# EasyEDA Pro project 四驱车.eprj

# Schematic 电机驱动板
Create Date: 2024-07-02; Page Name: P1; Project Name: 四驱车; Schematic Name: 电机驱动板; Update Date: 2024-08-28; Company: 嘉立创EDA; Page Size: A4; Version: V1.0
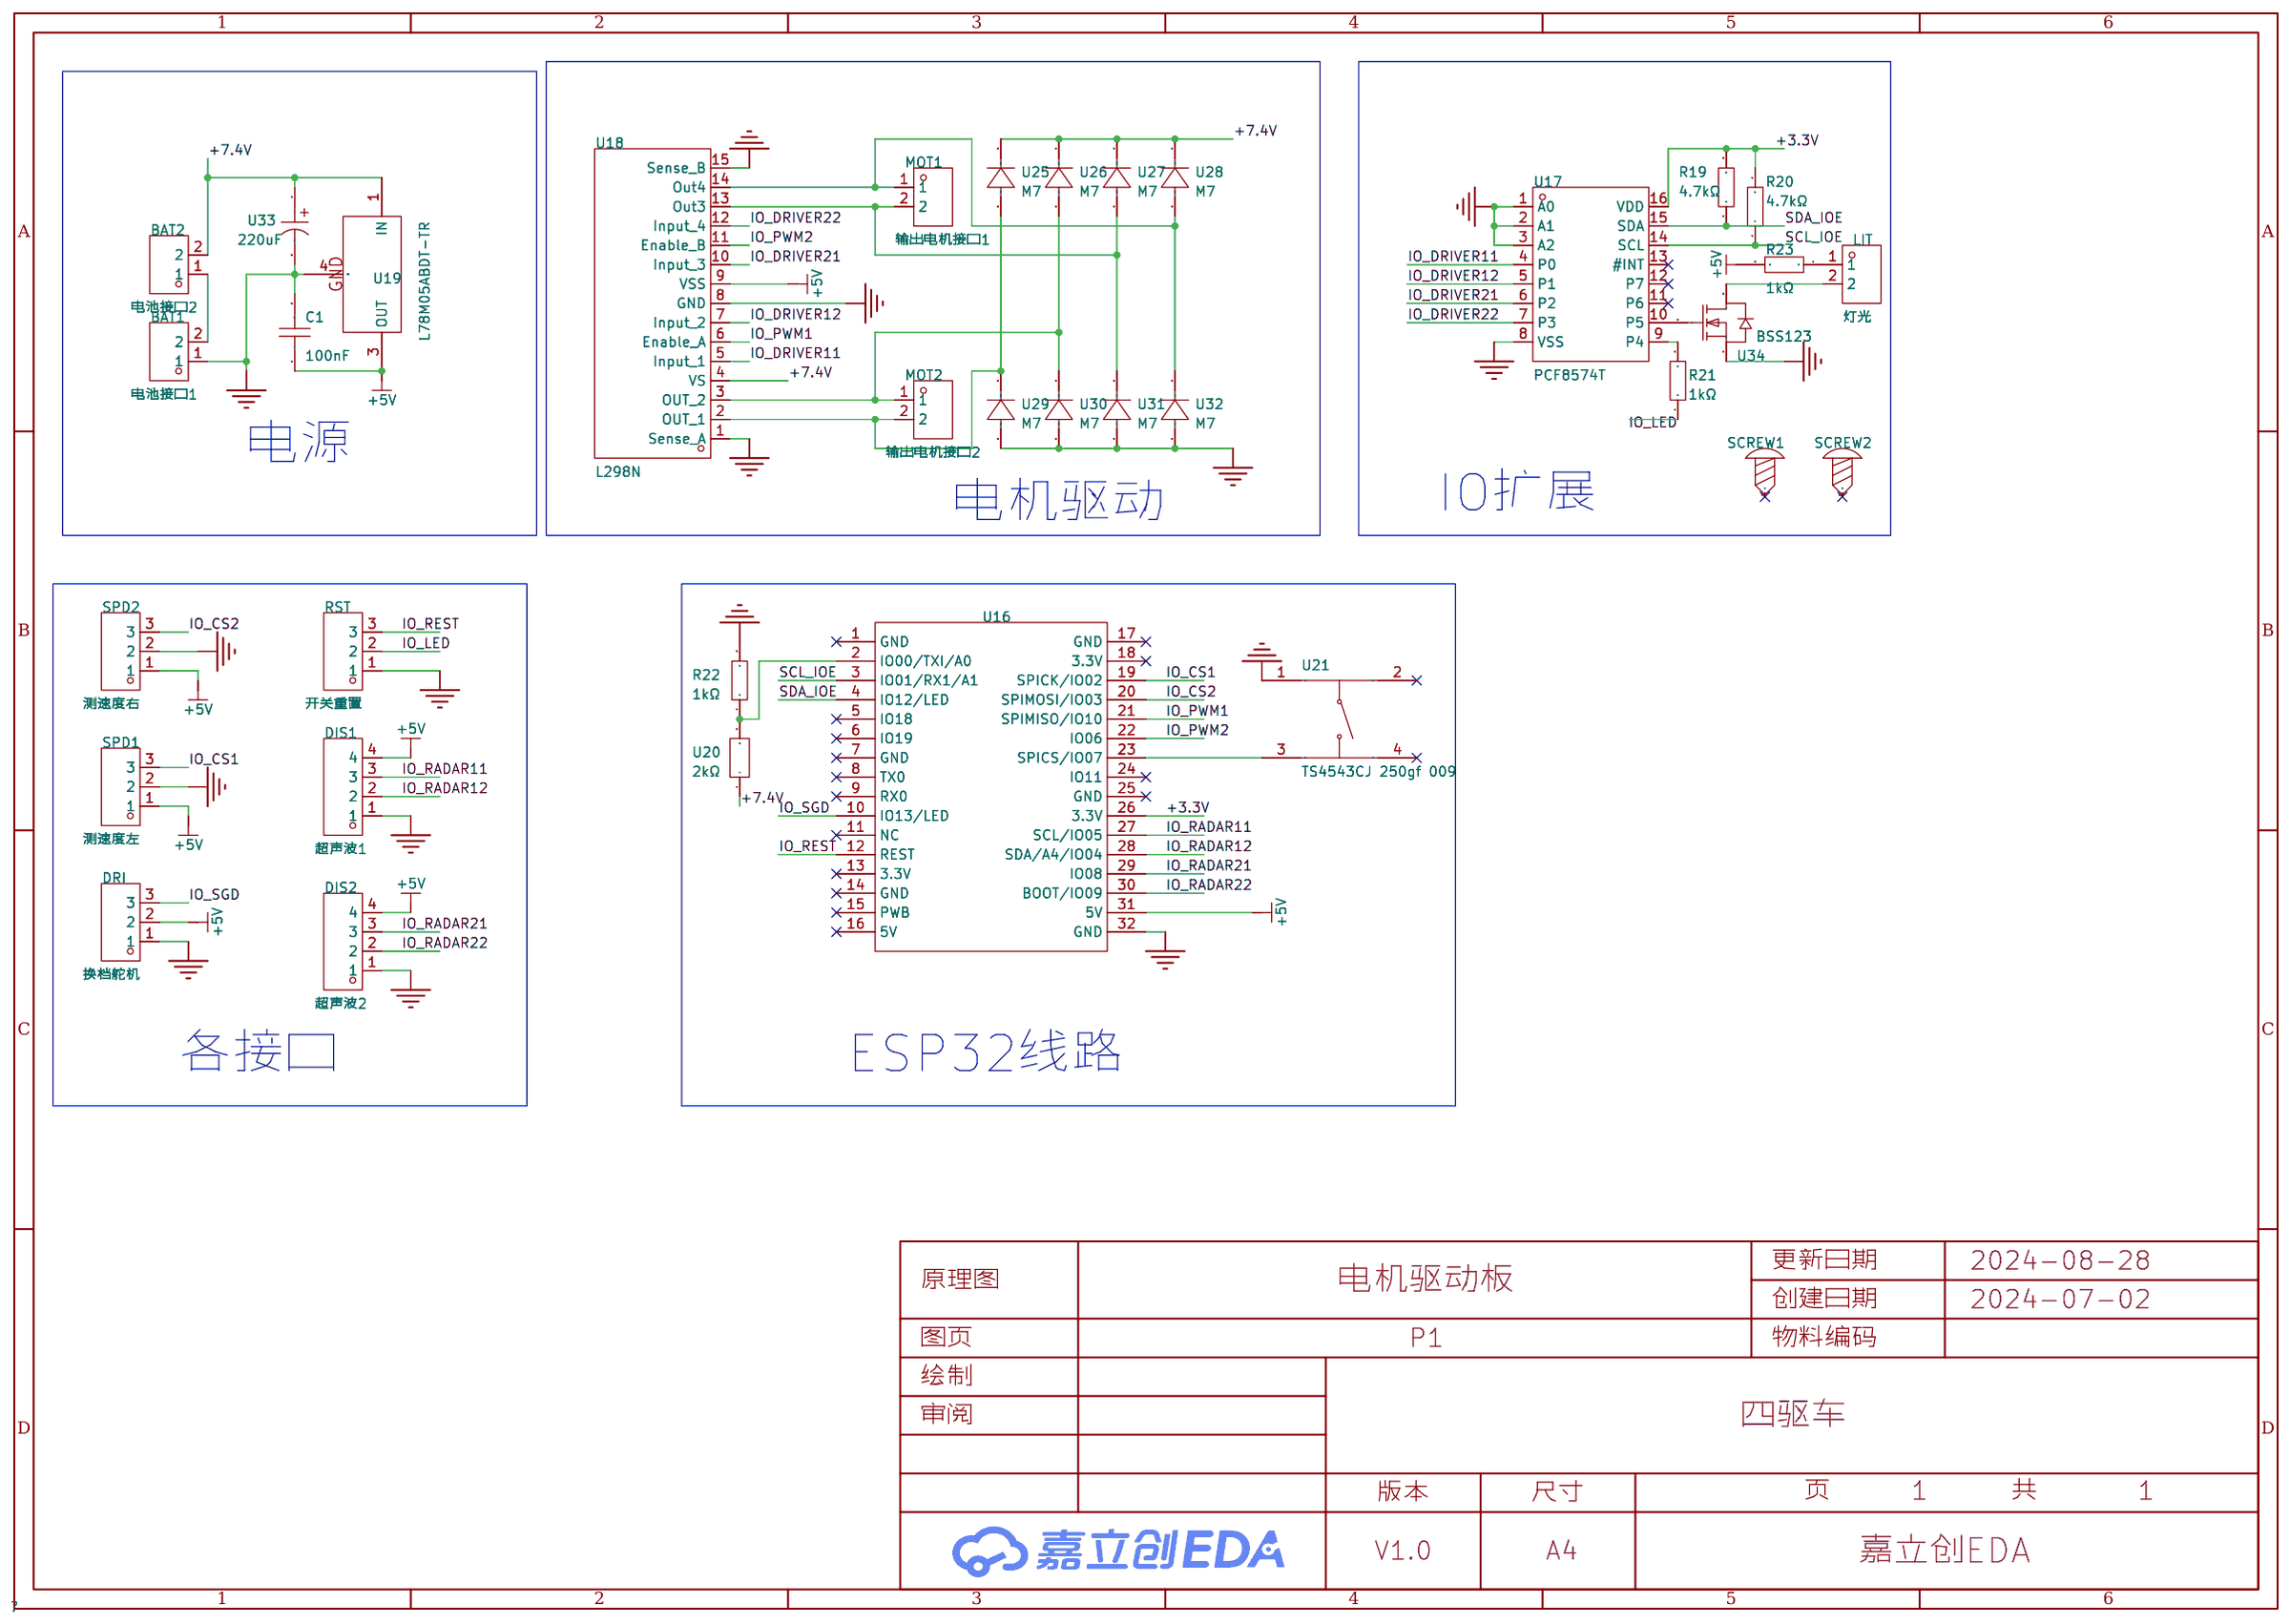
[diagram p0: schematic sheet]

## Parts
BAT1  电池接口1  [CONN-TH_2P-P2.50_HX25003-2A]
BAT2  电池接口2  [CONN-TH_2P-P2.50_HX25003-2A]
C1  100nF  [C0805]
DIS1  超声波1  [CONN-TH_4P-P2.50_4PIN]
DIS2  超声波2  [CONN-TH_4P-P2.50_4PIN]
DRI  换档舵机  [CONN-TH_3P-P2.54_2501S-3P]
LIT  灯光  [CONN-TH_2P-P2.50_HX25003-2A]
MOT1  输出电机接口1  [CONN-TH_2P-P2.50_HX25003-2A]
MOT2  输出电机接口2  [CONN-TH_2P-P2.50_HX25003-2A]
R19  4.7kΩ  [R0805]
R20  4.7kΩ  [R0805]
R21  1kΩ  [R0805]
R22  1kΩ  [R0805]
R23  1kΩ  [R0805]
RST  开关重置  [CONN-TH_3P-P2.54_2501S-3P]
SCREW1  -  [M2螺丝]
SCREW2  -  [M2螺丝]
SPD1  测速度左  [CONN-TH_3P-P2.54_2501S-3P]
SPD2  测速度右  [CONN-TH_3P-P2.54_2501S-3P]
U16  ESP32C3-合宙  [esp32c3-合宙]
U17  PCF8574T  [SOP-16_L10.3-W7.5-P1.27-LS10.4-BL]
U18  L298N  [MULTIWATT-15_L19.6-W5.0-P1.27-L]
U19  L78M05ABDT-TR  [TO-252-2_L6.5-W6.1-P4.58-LS10.0-TL]
U20  2kΩ  [R0603]
U21  TS4543CJ 250gf 009  [SW-TH_4P-L4.5-W4.5-P3.00-LS5.0]
U25  M7  [SMA_L4.5-W2.7-LS5.1-RD]
U26  M7  [SMA_L4.5-W2.7-LS5.1-RD]
U27  M7  [SMA_L4.5-W2.7-LS5.1-RD]
U28  M7  [SMA_L4.5-W2.7-LS5.1-RD]
U29  M7  [SMA_L4.5-W2.7-LS5.1-RD]
U30  M7  [SMA_L4.5-W2.7-LS5.1-RD]
U31  M7  [SMA_L4.5-W2.7-LS5.1-RD]
U32  M7  [SMA_L4.5-W2.7-LS5.1-RD]
U33  220uF  [CAP-SMD_BD8.0-L8.3-W8.3-LS9.1-FD]
U34  BSS123  [SOT-23-3_L2.9-W1.3-P1.90-LS2.4-BR]

## Library data of the parts
BAT1 BAT2 LIT MOT1 MOT2 = ZX-XH2.54-2PZZ: 插针结构:1x2P;间距:2.54mm;安装方式:直插;参考系列:XH;总PIN数:2P;排数:1;每排PIN数:2;行距:-;额定电流:3A;触头材质:黄铜;触头镀层:锡;工作温度范围:-25℃~+85℃;; Supplier Part: C7429632; Manufacturer: Megastar(兆星); Supplier Footprint: 插件,P=2.54mm; JLCPCB Part Class: Extended Part; Datasheet: https://atta.szlcsc.com/upload/public/pdf/source/20230619/19BA6947230AA44A04D3EDD65E618FD0.pdf; Supplier: LCSC; Pins Structure: 1x2P; Pitch: 2.54mm; Mounting Style: 直插; Reference Series: XH; Number of Pins: 2P; Number of Rows: 1; Number of PINs Per Row: 2; Current Rating (Max): 3A; Contact Material: 黄铜; Contact Plating: 锡; Operating Temperature Range: -25℃~+85℃
C1 = C0805B104K500NT: 容值:100nF;精度:±10%;额定电压:50V;材质(温度系数):X7R;; LCSC Part Name: 100nF ±10% 50V; Supplier Part: C476766; Manufacturer: TORCH(火炬); Supplier Footprint: 0805; JLCPCB Part Class: 扩展库; Datasheet: https://atta.szlcsc.com/upload/public/pdf/source/20191230/C476766_171E30D5B7F7164A8210B8E948DFBAE0.pdf; Supplier: LCSC; Tolerance: ±10%; Voltage Rated: 50V; Temperature Coefficient: X7R
DIS1 DIS2 = ZX-XH2.54-4PZZ: 插针结构:1x4P;间距:2.54mm;安装方式:直插;参考系列:XH;总PIN数:4P;排数:1;每排PIN数:4;行距:-;额定电流:3A;触头材质:黄铜;触头镀层:锡;工作温度范围:-25℃~+85℃;; Supplier Part: C7429634; Manufacturer: Megastar(兆星); Supplier Footprint: 插件,P=2.54mm; JLCPCB Part Class: 扩展库; Datasheet: https://atta.szlcsc.com/upload/public/pdf/source/20230619/B529A2163E0159A644AB3383D208FB03.pdf; Supplier: LCSC; Pins Structure: 1x4P; Pitch: 2.54mm; Mounting Style: 直插; Reference Series: XH; Number of Pins: 4P; Number of Rows: 1; Number of PINs Per Row: 4; Current Rating (Max): 3A; Contact Material: 黄铜; Contact Plating: 锡; Operating Temperature Range: -25℃~+85℃
DRI RST SPD1 SPD2 = ZX-XH2.54-3PZZ: 插针结构:1x3P;间距:2.54mm;安装方式:直插;参考系列:XH;总PIN数:3P;排数:1;每排PIN数:3;行距:-;额定电流:3A;触头材质:黄铜;触头镀层:锡;工作温度范围:-25℃~+85℃;; Supplier Part: C7429633; Manufacturer: Megastar(兆星); Supplier Footprint: 插件,P=2.54mm; JLCPCB Part Class: 扩展库; Datasheet: https://atta.szlcsc.com/upload/public/pdf/source/20230619/AE17037A2CFDBE8D9CBA775D61AD0A84.pdf; Supplier: LCSC; Pins Structure: 1x3P; Pitch: 2.54mm; Mounting Style: 直插; Reference Series: XH; Number of Pins: 3P; Number of Rows: 1; Number of PINs Per Row: 3; Current Rating (Max): 3A; Contact Material: 黄铜; Contact Plating: 锡; Operating Temperature Range: -25℃~+85℃
R19 R20 = 0805W8F4701T5E: 电阻类型:厚膜电阻;阻值:4.7kΩ;精度:±1%;功率:125mW;最大工作电压:150V;温度系数:±100ppm/℃;; LCSC Part Name: 4.7kΩ ±1% 125mW 厚膜电阻; Supplier Part: C17673; Manufacturer: UNI-ROYAL(厚声); Supplier Footprint: 0805; JLCPCB Part Class: 基础库; Datasheet: https://atta.szlcsc.com/upload/public/pdf/source/20200306/C422600_1E6D84923E4A46A82E41ADD87F860B5C.pdf; Supplier: LCSC; Type: 厚膜电阻; Tolerance: ±1%; Power(Watts): 125mW; Overload Voltage (Max): 150V; Temperature Coefficient: ±100ppm/℃; Operating Temperature Range: -55℃~+155℃
R21-R23 = RC0805FR-071KL: 电阻类型:厚膜电阻;阻值:1kΩ;精度:±1%;功率:125mW;最大工作电压:150V;温度系数:±100ppm/℃;; LCSC Part Name: 厚膜电阻 1kΩ ±1% 125mW; Supplier Part: C95781; Manufacturer: YAGEO(国巨); Supplier Footprint: 0805; JLCPCB Part Class: 扩展库; Datasheet: https://atta.szlcsc.com/upload/public/pdf/source/20170708/1499509500945.pdf; Supplier: LCSC; Type: 厚膜电阻; Tolerance: ±1%; Power(Watts): 125mW; Overload Voltage (Max): 150V; Temperature Coefficient: ±100ppm/℃; Operating Temperature Range: -55℃~+155℃
SCREW1 SCREW2 = M2螺丝: Supplier Footprint: 插件
U16 = ESP32C3-合宙: ESP32C3-核心板-经典
U17 = PCF8574T: 接口:I2C;I/O数量:8;时钟频率:100kHz;; LCSC Part Name: 端口扩展芯片; Supplier Part: C398075; Manufacturer: HGSEMI(华冠); Supplier Footprint: SOP-16-300mil; JLCPCB Part Class: Extended Part; Datasheet: https://atta.szlcsc.com/upload/public/pdf/source/20190611/C398075_1925312D8618E19C6137781D5B71A3CA.pdf; Supplier: LCSC; Interface: I2C; Number of I/O: 8; Interrupt Output: 有中断输出; Output Type: 推挽式; Supply Voltage: 2.5V~6V; Output Source current: 300uA; Output Sink Current: 25mA; Clock Frequency: 100kHz; Operating Temperature: -40℃~+85℃
U18 = L298N_C19922: 驱动配置:半桥;电源电压:4.5V~7V;; Supplier Part: C19922; Manufacturer: ST(意法半导体); Supplier Footprint: MultiwAtt-15; JLCPCB Part Class: 扩展库; Datasheet: https://atta.szlcsc.com/upload/public/pdf/source/20131014/1457706655076.pdf; Supplier: LCSC; Driven Configuration: 半桥; Supply Voltage: 4.5V~7V; Feature: 过流保护(OCP)；过热保护(OPT); Operating Temperature: -40℃~+150℃@(Tj)
U19 = L78M05ABDT-TR: 输出类型:固定;最大输入电压:35V;输出电压:5V;最大输出电流:500mA;电源纹波抑制比(PSRR):62dB@(120Hz);输出极性:正极;; LCSC Part Name: 输入35V 输出5V 500mA; Supplier Part: C58069; Manufacturer: ST(意法半导体); Supplier Footprint: TO-252-2(DPAK); JLCPCB Part Class: 基础库; Datasheet: https://atta.szlcsc.com/upload/public/pdf/source/20230728/311D30A65517FCBD6FE5D1CCA2CA8430.pdf; Supplier: LCSC; Output Type: 固定; Maximum Input Voltage: 35V; Output Voltage: 5V; MAX Output Current: 500mA; Power Supply Rejection Ratio (PSRR): 62dB@(120Hz); standby current: 6mA; Operating Temperature: -40℃~+125℃; Output Polarity: 正极; Number of Outputs: 1
U20 = RCA032KFLF: 阻值:2kΩ;精度:±1%;功率:100mW;; LCSC Part Name: 2kΩ ±1% 100mW; Supplier Part: C22369799; Manufacturer: HKR(香港电阻); Supplier Footprint: 0603; JLCPCB Part Class: 扩展库; Datasheet: https://atta.szlcsc.com/upload/public/pdf/source/20240327/626E23E3B2A799D2C85303DE2C37BB2A.pdf; Supplier: LCSC; Tolerance: ±1%; Power(Watts): 100mW
U21 = TS4543CJ 250gf 009: 电路结构:单刀单掷;按钮形状:圆形按钮;作用力:250gf;安装方式:直插;开关长度:4.5mm;开关宽度:4.5mm;开关高度:4.3mm;带支架:不带;触点电流:50mA;额定电压(AC):-;额定电压(DC):12V;额定功率:-;绝缘电阻:100MΩ;带灯:无;机械寿命:10万次;; LCSC Part Name: 4.5*4.5*4.3mm 立插 轻触开关; Supplier Part: C5359331; Manufacturer: SHOU HAN(首韩); Supplier Footprint: 插件; JLCPCB Part Class: 扩展库; Datasheet: https://atta.szlcsc.com/upload/public/pdf/source/20230213/DC0D7DCCF73BB7038FD4B4E5EA59A8FD.pdf; Supplier: LCSC; Circuit: 单刀单掷; Actuator Style: 圆形按钮; Operating Force: 250gf; Mounting Style: 直插; Switch Length: 4.5mm; Switch Width: 4.5mm; Switch Height: 4.3mm; Strike Gundam: 不带; Contact Current: 50mA; Voltage Rating (DC): 12V; Insulation Resistance: 100MΩ; Actuator/Cap Color: 黑色; With Lamp: 无; Mechanical Life: 10万次; Operating Temperature: -25℃~+70℃
U25-U32 = M7_C2902910: 二极管配置:-;正向压降(Vf):1.1V@1A;直流反向耐压(Vr):1kV;整流电流:1A;; LCSC Part Name: 电压:1kV 电流:1A; Supplier Part: C2902910; Manufacturer: MSKSEMI(美森科); Supplier Footprint: DO-214AC; JLCPCB Part Class: 扩展库; Datasheet: https://atta.szlcsc.com/upload/public/pdf/source/20230818/6D837163743024F173AA17A66C45A9BC.pdf; Supplier: LCSC; Forward Voltage (Vf@If): 1.1V@1A; Reverse Voltage (Vr): 1kV; Rectified Current: 1A; Reverse Leakage Current: 5uA@1kV
U33 = RVT1V221M0810 220UF 35V: 容值:220uF;精度:±20%;额定电压:35V;纹波电流:195mA@120Hz;等效串联电阻:-;; LCSC Part Name: 220uF ±20% 35V; Supplier Part: C970697; Manufacturer: DMBJ(振宝佳); Supplier Footprint: SMD,D8xL10.2mm; JLCPCB Part Class: 扩展库; Datasheet: https://atta.szlcsc.com/upload/public/pdf/source/20201217/C970594_282EC4D70669AEE33806F6C24A5FAA0B.pdf; Supplier: LCSC; Tolerance: ±20%; Rated Voltage: 35V; Ripple Current: 195mA@120Hz; φD: 8mm; L: 10.2mm; Lifetime @ Temp: 2800hrs@105℃; Operating Temperature: -55℃~+105℃
U34 = BSS123_C7420338: 类型:N沟道;漏源电压(Vdss):100V;连续漏极电流(Id):200mA;功率(Pd):350mW;导通电阻(RDS(on)@Vgs,Id):5Ω@10V,0.2A;阈值电压(Vgs(th)@Id):2.5V@250uA;; LCSC Part Name: N沟道 耐压:100V 电流:200mA; Supplier Part: C7420338; Manufacturer: 宏迦橙; Supplier Footprint: SOT-23; JLCPCB Part Class: 扩展库; Datasheet: https://atta.szlcsc.com/upload/public/pdf/source/20230828/221D2EA3EA52D2251D08D49BEAAE0395.pdf; Supplier: LCSC; Type: N沟道; Drain Source Voltage (Vdss): 100V; Continuous Drain Current (Id): 200mA; Power Dissipation (Pd): 350mW; Drain Source On Resistance (RDS(on)@Vgs,Id): 5Ω@10V,0.2A; Gate Threshold Voltage (Vgs(th)@Id): 2.5V@250uA; Total Gate Charge (Qg@Vgs): 1.4nC@10V; Input Capacitance (Ciss@Vds): 32pF@50V; Reverse Transfer Capacitance (Crss@Vds): 7pF@50V; Operating Temperature: -55℃~+150℃

## Nets
+3.3V: R19.2 R20.2 U16.26(3.3V) U17.16(VDD)
+5V: C1.1 DIS1.4 DIS2.4 DRI.2 R23.2 SPD1.1 SPD2.1 U16.31(5V) U18.9(VSS) U19.3(OUT)
+7.4V: BAT2.2 U18.4(VS) U19.1(IN) U20.1 U25.1(Cathode) U26.1(Cathode) U27.1(Cathode) U28.1(Cathode) U33.1
GND: BAT1.1 C1.2 DIS1.1 DIS2.1 DRI.1 R22.2 RST.1 SPD1.2 SPD2.2 U16.32(GND) U17.1(A0) U17.2(A1) U17.3(A2) U17.8(VSS) U18.1(Sense A) U18.8(GND) U18.15(Sense B) U19.4(GND) U21.1 U29.2(Anode) U30.2(Anode) U31.2(Anode) U32.2(Anode) U33.2 U34.2(S)
IO_CS1: SPD1.3 U16.19(SPICK/IO02)
IO_CS2: SPD2.3 U16.20(SPIMOSI/IO03)
IO_DRIVER11: U17.4(P0) U18.5(Input 1)
IO_DRIVER12: U17.5(P1) U18.7(Input 2)
IO_DRIVER21: U17.6(P2) U18.10(Input 3)
IO_DRIVER22: U17.7(P3) U18.12(Input 4)
IO_LED: R21.1 RST.2
IO_PWM1: U16.21(SPIMISO/IO10) U18.6(Enable A)
IO_PWM2: U16.22(IO06) U18.11(Enable B)
IO_RADAR11: DIS1.3 U16.27(SCL/IO05)
IO_RADAR12: DIS1.2 U16.28(SDA/A4/IO04)
IO_RADAR21: DIS2.3 U16.29(IO08)
IO_RADAR22: DIS2.2 U16.30(BOOT/IO09)
IO_REST: RST.3 U16.12(REST)
IO_SGD: DRI.3 U16.10(IO13/LED)
SCL_IOE: R20.1 U16.3(IO01/RX1/A1) U17.14(SCL)
SDA_IOE: R19.1 U16.4(IO12/LED) U17.15(SDA)
$1N15876: BAT1.2 BAT2.1
$1N17735: R22.1 U16.2(IO00/TXI/A0) U20.2
$1N18534: U16.23(SPICS/IO07) U21.3
$1N19447: MOT2.1 U18.3(OUT 2) U26.2(Anode) U30.1(Cathode)
$1N19452: MOT2.2 U18.2(OUT 1) U25.2(Anode) U29.1(Cathode)
$1N19565: MOT1.1 U18.14(Out4) U28.2(Anode) U32.1(Cathode)
$1N19566: MOT1.2 U18.13(Out3) U27.2(Anode) U31.1(Cathode)
$1N24130: R21.2 U17.9(P4)
$1N26486: U17.10(P5) U34.1(G)
$1N26625: LIT.2 U34.3(D)
$1N26643: LIT.1 R23.1

Not connected (* = marked no-connect by the designer): SCREW1 1*; SCREW2 1*; U16 1(GND)* 5(IO18)* 6(IO19)* 7(GND)* 8(TX0)* 9(RX0)* 11(NC)* 13(3.3V)* 14(GND)* 15(PWB)* 16(5V)* 17(GND)* 18(3.3V)* 24(IO11)* 25(GND)*; U17 11(P6)* 12(P7)* 13(#INT)*; U21 2* 4*

## Notes on the sheet
- 电源
- 电机驱动
- IO扩展
- 各接口
- ESP32线路

# Schematic TP2326充电
Create Date: 2024-08-18; Page Name: P1; Project Name: 四驱车; Schematic Name: Schematic2; Update Date: 2024-08-18; Company: 嘉立创EDA; Page Size: A4; Version: V1.0
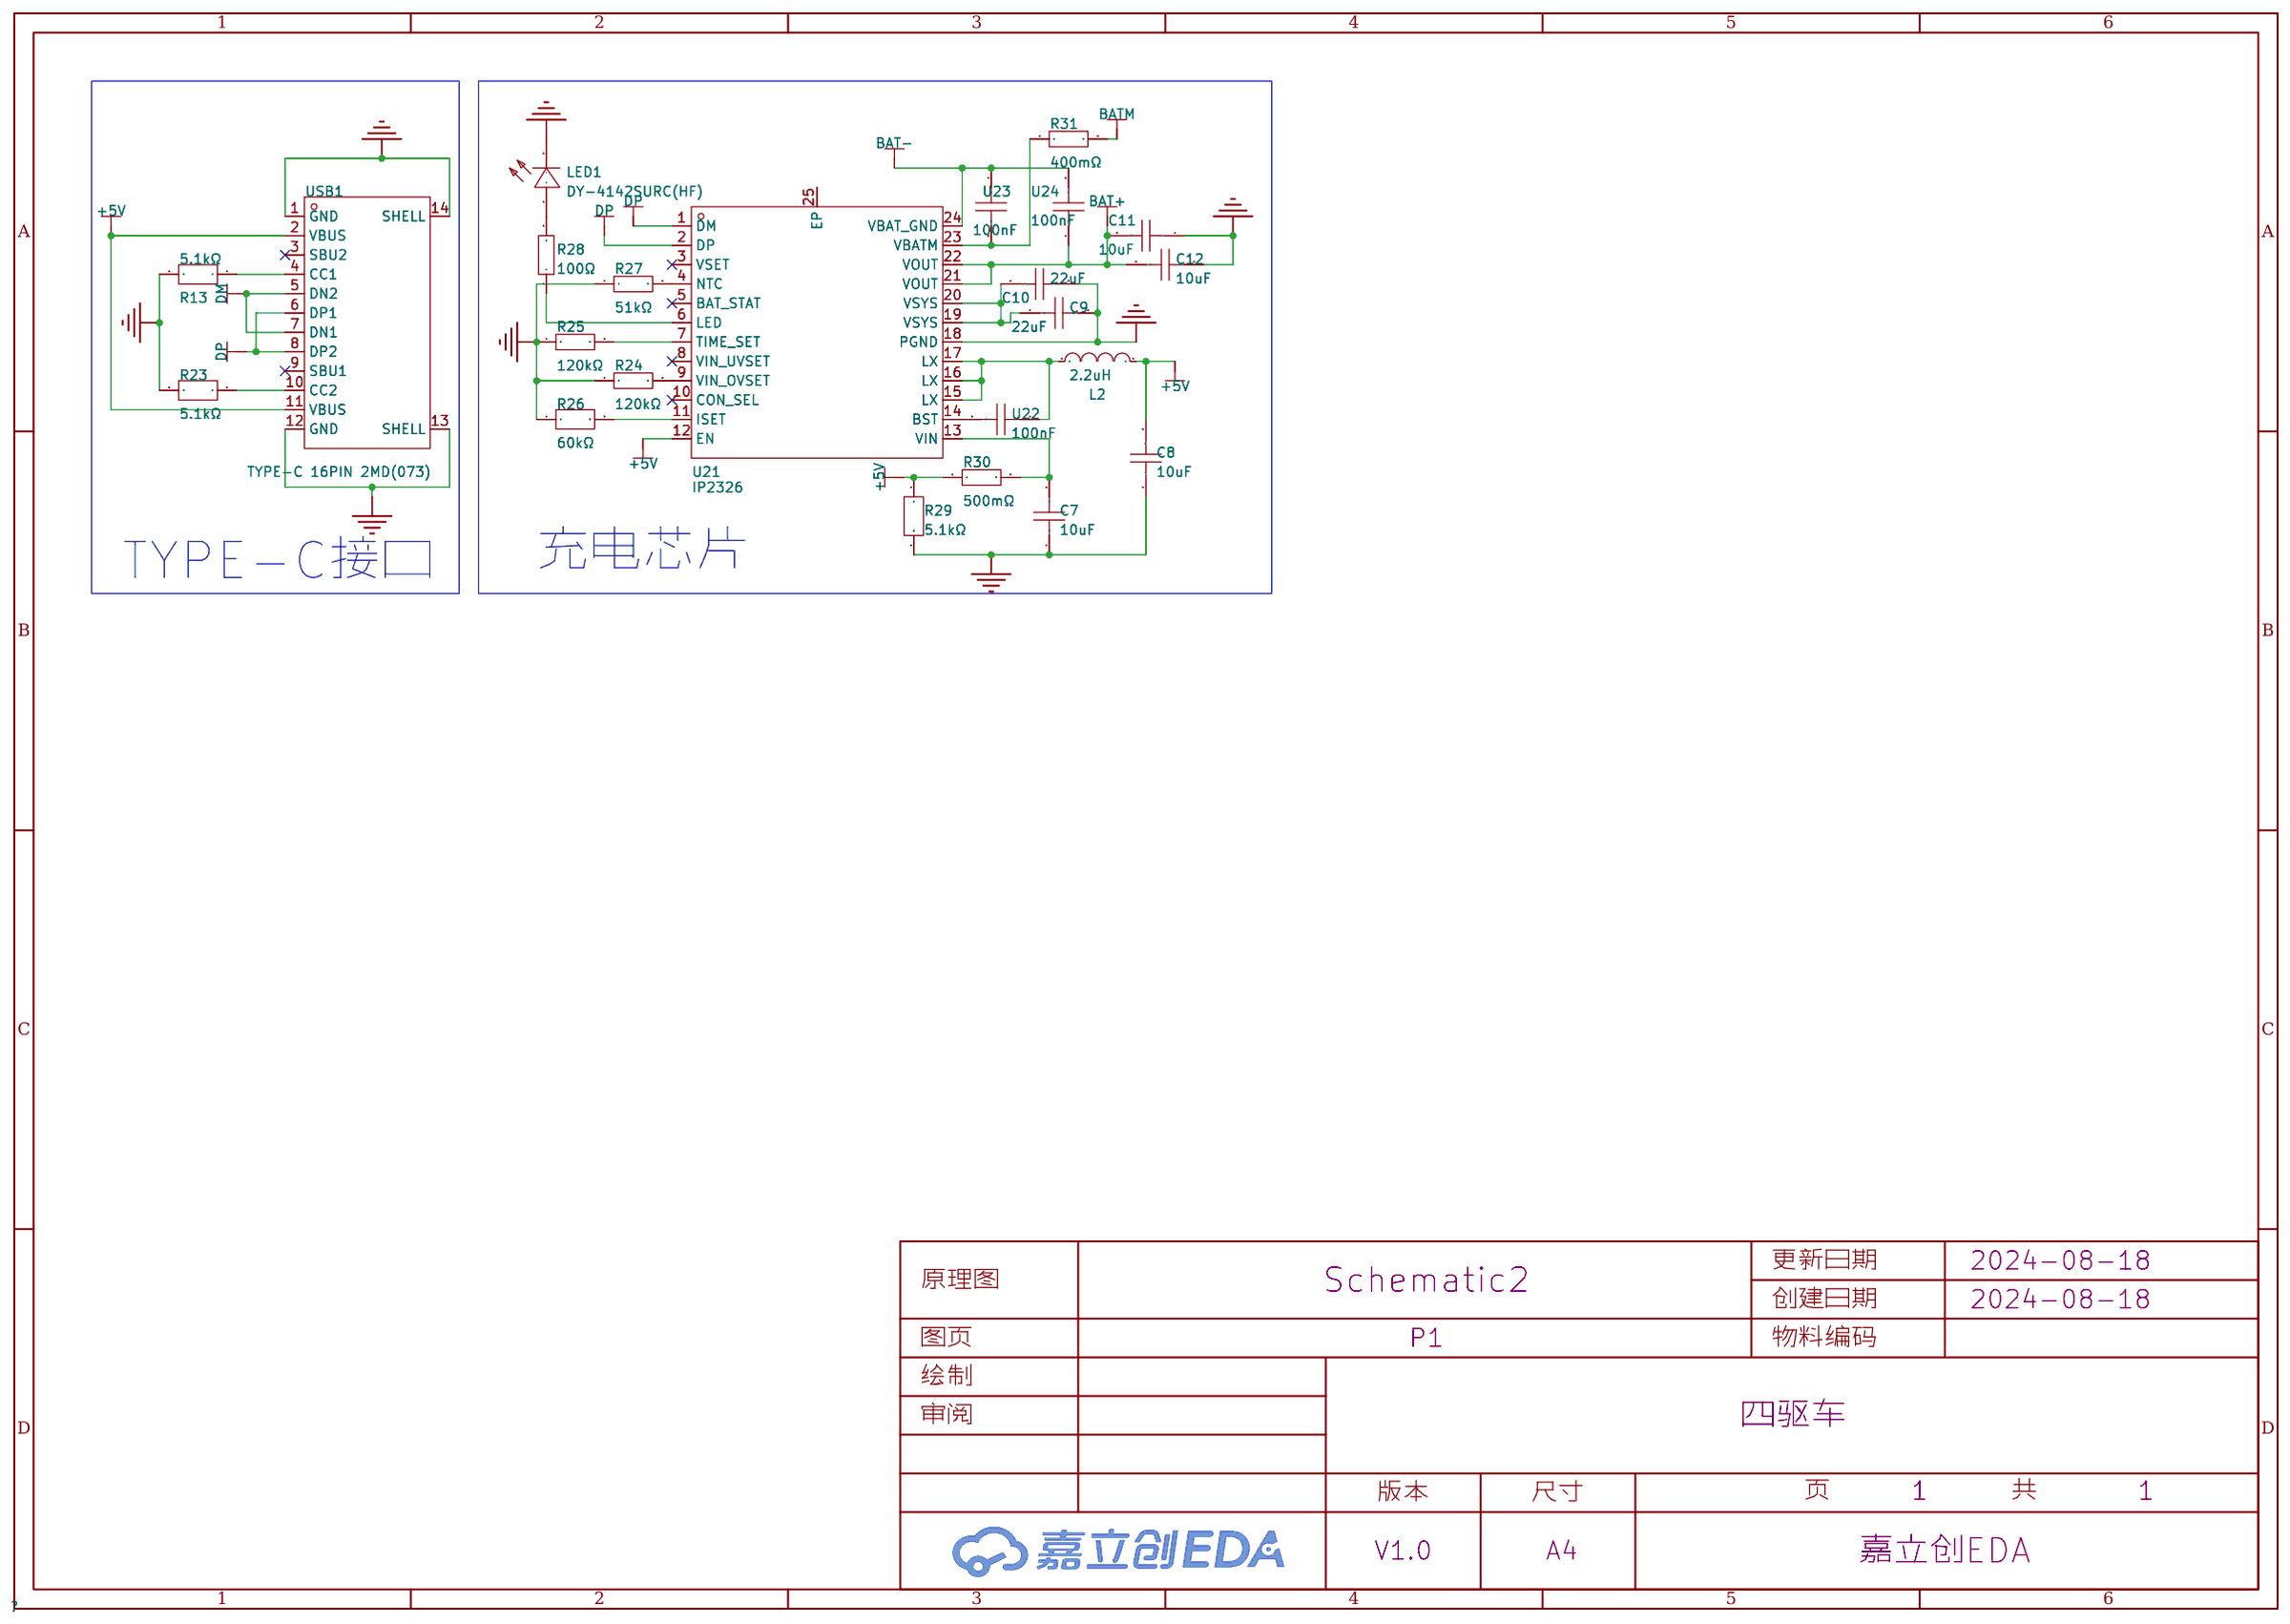
[diagram p1: schematic sheet]

## Parts
C7  10uF  [C0603]
C8  10uF  [C0603]
C9  22uF  [C0603]
C10  22uF  [C0603]
C11  10uF  [C0603]
C12  10uF  [C0603]
L2  2.2uH  [IND-SMD_L7.8-W7.0_SCD0705N]
LED1  DY-4142SURC(HF)  [LED-TH_BD5.0-P2.54-FD]
R13  5.1kΩ  [R0603]
R23  5.1kΩ  [R0603]
R24  120kΩ  [R0603]
R25  120kΩ  [R0603]
R26  60kΩ  [R0603]
R27  51kΩ  [R0603]
R28  100Ω  [R0603]
R29  5.1kΩ  [R0603]
R30  500mΩ  [R0603]
R31  400mΩ  [R0603]
U21  IP2326  [VQFN-24_L4.0-W4.0-P0.50-BL-EP2.5]
U22  100nF  [C0603]
U23  100nF  [C0603]
U24  100nF  [C0603]
USB1  TYPE-C 16PIN 2MD(073)  [USB-C-SMD_TYPE-C-6PIN-2MD-073]

## Library data of the parts
C7 C8 C11 C12 = CL10A106MQ8NNNC: 容值:10uF;精度:±20%;额定电压:6.3V;材质(温度系数):X5R;; LCSC Part Name: 10uF ±20% 6.3V; Supplier Part: C1691; Manufacturer: SAMSUNG(三星); Supplier Footprint: 0603; JLCPCB Part Class: 扩展库; Datasheet: https://atta.szlcsc.com/upload/public/pdf/source/20160218/1457707763339.pdf; Supplier: LCSC; Tolerance: ±20%; Voltage Rated: 6.3V; Temperature Coefficient: X5R
C9 C10 = CL10A226MQ8NRNC: 容值:22uF;精度:±20%;额定电压:6.3V;材质(温度系数):X5R;; LCSC Part Name: 22uF ±20% 6.3V; Supplier Part: C59461; Manufacturer: SAMSUNG(三星); Supplier Footprint: 0603; JLCPCB Part Class: 基础库; Datasheet: https://atta.szlcsc.com/upload/public/pdf/source/20160218/1457707763339.pdf; Supplier: LCSC; Tolerance: ±20%; Voltage Rated: 6.3V; Temperature Coefficient: X5R
L2 = SM7850-2R2MT: 电感值:2.2uH;精度:±20%;额定电流:-;饱和电流(Isat):6A;; LCSC Part Name: 2.2uH ±20% 6A; Supplier Part: C9908; Manufacturer: SXN(顺翔诺); Supplier Footprint: SMD; JLCPCB Part Class: 扩展库; Datasheet: https://atta.szlcsc.com/upload/public/pdf/source/20210810/DE909F839CF261ABDAA312DFDF4FA1A6.pdf; Supplier: LCSC; Tolerance: ±20%; Saturation Current (Isat): 6A; DC Resistance (DCR): 15mΩ
LED1 = DY-4142SURC(HF): 灯头类型:5.1mm圆柱形灯头;发光颜色:红色;正向电压(VF):1.8V~2.4V;功率:60mW;正向电流:20mA;主波长:620nm~630nm;二极管配置:-;透镜颜色:无色透明透镜;色温:-;发光强度:63mcd~200mcd;发光角度:85°;载带方式:-;工作温度:-25℃~+80℃;; Supplier Part: C459127; Manufacturer: TONYU(东裕); Supplier Footprint: 插件,D=5.1mm; JLCPCB Part Class: 扩展库; Datasheet: https://atta.szlcsc.com/upload/public/pdf/source/20191121/C459127_C28EC13B80F89695C0023DDCA5A32C9E.pdf; Supplier: LCSC; Lamp Holder Type: 5.1mm圆柱形灯头; Emitted Color: 红色; Forward Voltage (VF): 1.8V~2.4V; Power Dissipation: 60mW; Forward Current: 20mA; Dominant Wavelength: 620nm~630nm; Peak Wavelength: 633nm; Lens Color: 无色透明透镜; Luminous Intensity: 63mcd~200mcd; Viewing Angle: 85°; Operating Temperature: -25℃~+80℃
R13 R23 R29 = SCR0603J5K1: 电阻类型:厚膜电阻;阻值:5.1kΩ;精度:±5%;功率:100mW;最大工作电压:75V;; LCSC Part Name: 厚膜电阻 5.1kΩ ±5% 100mW; Supplier Part: C3017721; Manufacturer: VO(翔胜); Supplier Footprint: 0603; JLCPCB Part Class: 扩展库; Datasheet: https://atta.szlcsc.com/upload/public/pdf/source/20220513/247AF9639BA21CF93567DC289CCC6A22.pdf; Supplier: LCSC; Type: 厚膜电阻; Tolerance: ±5%; Power(Watts): 100mW; Overload Voltage (Max): 75V; Operating Temperature Range: -55℃~+155℃
R24 R25 = 0603WAF1203T5E: 电阻类型:厚膜电阻;阻值:120kΩ;精度:±1%;功率:100mW;最大工作电压:75V;温度系数:±100ppm/℃;; LCSC Part Name: 120kΩ ±1% 100mW 厚膜电阻; Supplier Part: C25808; Manufacturer: UNI-ROYAL(厚声); Supplier Footprint: 0603; JLCPCB Part Class: 基础库; Datasheet: https://atta.szlcsc.com/upload/public/pdf/source/20200306/C422600_1E6D84923E4A46A82E41ADD87F860B5C.pdf; Supplier: LCSC; Type: 厚膜电阻; Tolerance: ±1%; Power(Watts): 100mW; Overload Voltage (Max): 75V; Temperature Coefficient: ±100ppm/℃; Operating Temperature Range: -55℃~+155℃
R26 = 0603WAF6002T5E: 电阻类型:厚膜电阻;阻值:60kΩ;精度:±1%;功率:100mW;最大工作电压:75V;温度系数:±100ppm/℃;; LCSC Part Name: 60kΩ ±1% 100mW 厚膜电阻; Supplier Part: C2767205; Manufacturer: UNI-ROYAL(厚声); Supplier Footprint: 0603; JLCPCB Part Class: 扩展库; Datasheet: https://atta.szlcsc.com/upload/public/pdf/source/20200306/C422600_1E6D84923E4A46A82E41ADD87F860B5C.pdf; Supplier: LCSC; Type: 厚膜电阻; Tolerance: ±1%; Power(Watts): 100mW; Overload Voltage (Max): 75V; Temperature Coefficient: ±100ppm/℃; Operating Temperature Range: -55℃~+155℃
R27 = 0603WAF5102T5E: 电阻类型:厚膜电阻;阻值:51kΩ;精度:±1%;功率:100mW;最大工作电压:75V;温度系数:±100ppm/℃;; LCSC Part Name: 51kΩ ±1% 100mW 厚膜电阻; Supplier Part: C23196; Manufacturer: UNI-ROYAL(厚声); Supplier Footprint: 0603; JLCPCB Part Class: 基础库; Datasheet: https://atta.szlcsc.com/upload/public/pdf/source/20200306/C422600_1E6D84923E4A46A82E41ADD87F860B5C.pdf; Supplier: LCSC; Type: 厚膜电阻; Tolerance: ±1%; Power(Watts): 100mW; Overload Voltage (Max): 75V; Temperature Coefficient: ±100ppm/℃; Operating Temperature Range: -55℃~+155℃
R28 = RC0603FR-07100RL: 电阻类型:厚膜电阻;阻值:100Ω;精度:±1%;功率:100mW;最大工作电压:75V;温度系数:±100ppm/℃;; LCSC Part Name: 厚膜电阻 100Ω ±1% 100mW; Supplier Part: C105588; Manufacturer: YAGEO(国巨); Supplier Footprint: 0603; JLCPCB Part Class: 扩展库; Datasheet: https://atta.szlcsc.com/upload/public/pdf/source/20180316/70C0E2BDAE7FCC62C531A5A58D202EE1.pdf; Supplier: LCSC; Type: 厚膜电阻; Tolerance: ±1%; Power(Watts): 100mW; Overload Voltage (Max): 75V; Temperature Coefficient: ±100ppm/℃; Operating Temperature Range: -55℃~+155℃
R30 = 0603WAF500LT5E: 电阻类型:厚膜电阻;阻值:500mΩ;精度:±1%;功率:100mW;最大工作电压:75V;温度系数:±800ppm/℃;; LCSC Part Name: 500mΩ ±1% 100mW 厚膜电阻; Supplier Part: C45312; Manufacturer: UNI-ROYAL(厚声); Supplier Footprint: 0603; JLCPCB Part Class: 扩展库; Datasheet: https://atta.szlcsc.com/upload/public/pdf/source/20200306/C422600_1E6D84923E4A46A82E41ADD87F860B5C.pdf; Supplier: LCSC; Type: 厚膜电阻; Tolerance: ±1%; Power(Watts): 100mW; Overload Voltage (Max): 75V; Temperature Coefficient: ±800ppm/℃; Operating Temperature Range: -55℃~+155℃
R31 = 0603WAJ040KT5E: 电阻类型:厚膜电阻;阻值:400mΩ;精度:±5%;功率:100mW;最大工作电压:75V;; LCSC Part Name: 400mΩ ±5% 100mW 厚膜电阻; Supplier Part: C2907422; Manufacturer: UNI-ROYAL(厚声); Supplier Footprint: 0603; JLCPCB Part Class: 扩展库; Supplier: LCSC; Type: 厚膜电阻; Tolerance: ±5%; Power(Watts): 100mW; Overload Voltage (Max): 75V; Operating Temperature Range: -55℃~+155℃
U21 = IP2326: Supplier Part: C2832094; Manufacturer: INJOINIC(英集芯); Supplier Footprint: VQFN-24-EP(4x4); JLCPCB Part Class: 扩展库; Datasheet: https://atta.szlcsc.com/upload/public/pdf/source/20210701/C2832094_E17C44C11E64EBC07E8B83E7E48DDEF6.pdf; Supplier: LCSC
U22-U24 = CGA0603X7R104K500JT: 容值:100nF;精度:±10%;额定电压:50V;材质(温度系数):X7R;; LCSC Part Name: 100nF ±10% 50V; Supplier Part: C6119867; Manufacturer: HRE(芯声); Supplier Footprint: 0603; JLCPCB Part Class: 扩展库; Supplier: LCSC; Tolerance: ±10%; Voltage Rated: 50V; Temperature Coefficient: X7R
USB1 = TYPE-C 16PIN 2MD(073): 连接器类型:Type-C;标准:-;公母:母;端口数量:1;触点数量:16P;安装方式:卧贴;额定电流 - 电源:5A;工作温度范围:-25℃~+85℃;; LCSC Part Name: Type-C 母 卧贴; Supplier Part: C2765186; Manufacturer: SHOU HAN(首韩); Supplier Footprint: SMD; JLCPCB Part Class: 扩展库; Datasheet: https://atta.szlcsc.com/upload/public/pdf/source/20211123/39B17C16241EAC15C5E277BDA434118E.pdf; Supplier: LCSC; Connector Type: Type-C; Gender: 母; Number of Ports: 1; Number of Contacts: 16P; Mounting Style: 卧贴; Current Rating - Power (Max): 5A; Operating Temperature Range: -25℃~+85℃

## Nets
+5V: C8.2 L2.2 R29.1 R30.1 U21.12(EN) USB1.2(VBUS) USB1.11(VBUS)
GND: C7.1 C8.1 C9.2 C10.2 C11.1 C12.1 LED1.2(-) R13.2 R23.2 R24.1 R25.1 R26.1 R27.1 R29.2 U21.18(PGND) USB1.1(GND) USB1.12(GND) USB1.13(SHELL) USB1.14(SHELL)
BAT+: C11.2 C12.2 U21.21(VOUT) U21.22(VOUT) U24.1
BAT-: U21.24(VBAT_GND) U23.1 U24.2
BATM: R31.2
DM: USB1.5(DN2) USB1.7(DN1)
DP: U21.1(DM) U21.2(DP) USB1.6(DP1) USB1.8(DP2)
Net-(C7-2): C7.2 R30.2 U21.13(VIN)
Net-(C9-1): C9.1 C10.1 U21.19(VSYS) U21.20(VSYS)
Net-(L2-1): L2.1 U21.15(LX) U21.16(LX) U21.17(LX) U22.1
Net-(LED1-1): LED1.1(+) R28.2
Net-(R13-1): R13.1 USB1.4(CC1)
Net-(R23-1): R23.1 USB1.10(CC2)
Net-(R24-2): R24.2 U21.9(VIN_OVSET)
Net-(R25-2): R25.2 U21.7(TIME_SET)
Net-(R26-2): R26.2 U21.11(ISET)
Net-(R27-2): R27.2 U21.4(NTC)
Net-(R28-1): R28.1 U21.6(LED)
Net-(R31-1): R31.1 U21.23(VBATM) U23.2
Net-(U21-14): U21.14(BST) U22.2

Not connected (* = marked no-connect by the designer): U21 3(VSET)* 5(BAT_STAT)* 8(VIN_UVSET)* 10(CON_SEL)* 25(EP); USB1 3(SBU2)* 9(SBU1)*

## Notes on the sheet
- TYPE-C接口
- 充电芯片

# Schematic 状态及开关
Create Date: 2024-08-26; Page Name: P1; Project Name: 四驱车; Schematic Name: Schematic1; Update Date: 2024-08-26; Company: 嘉立创EDA; Page Size: A4; Version: V1.0
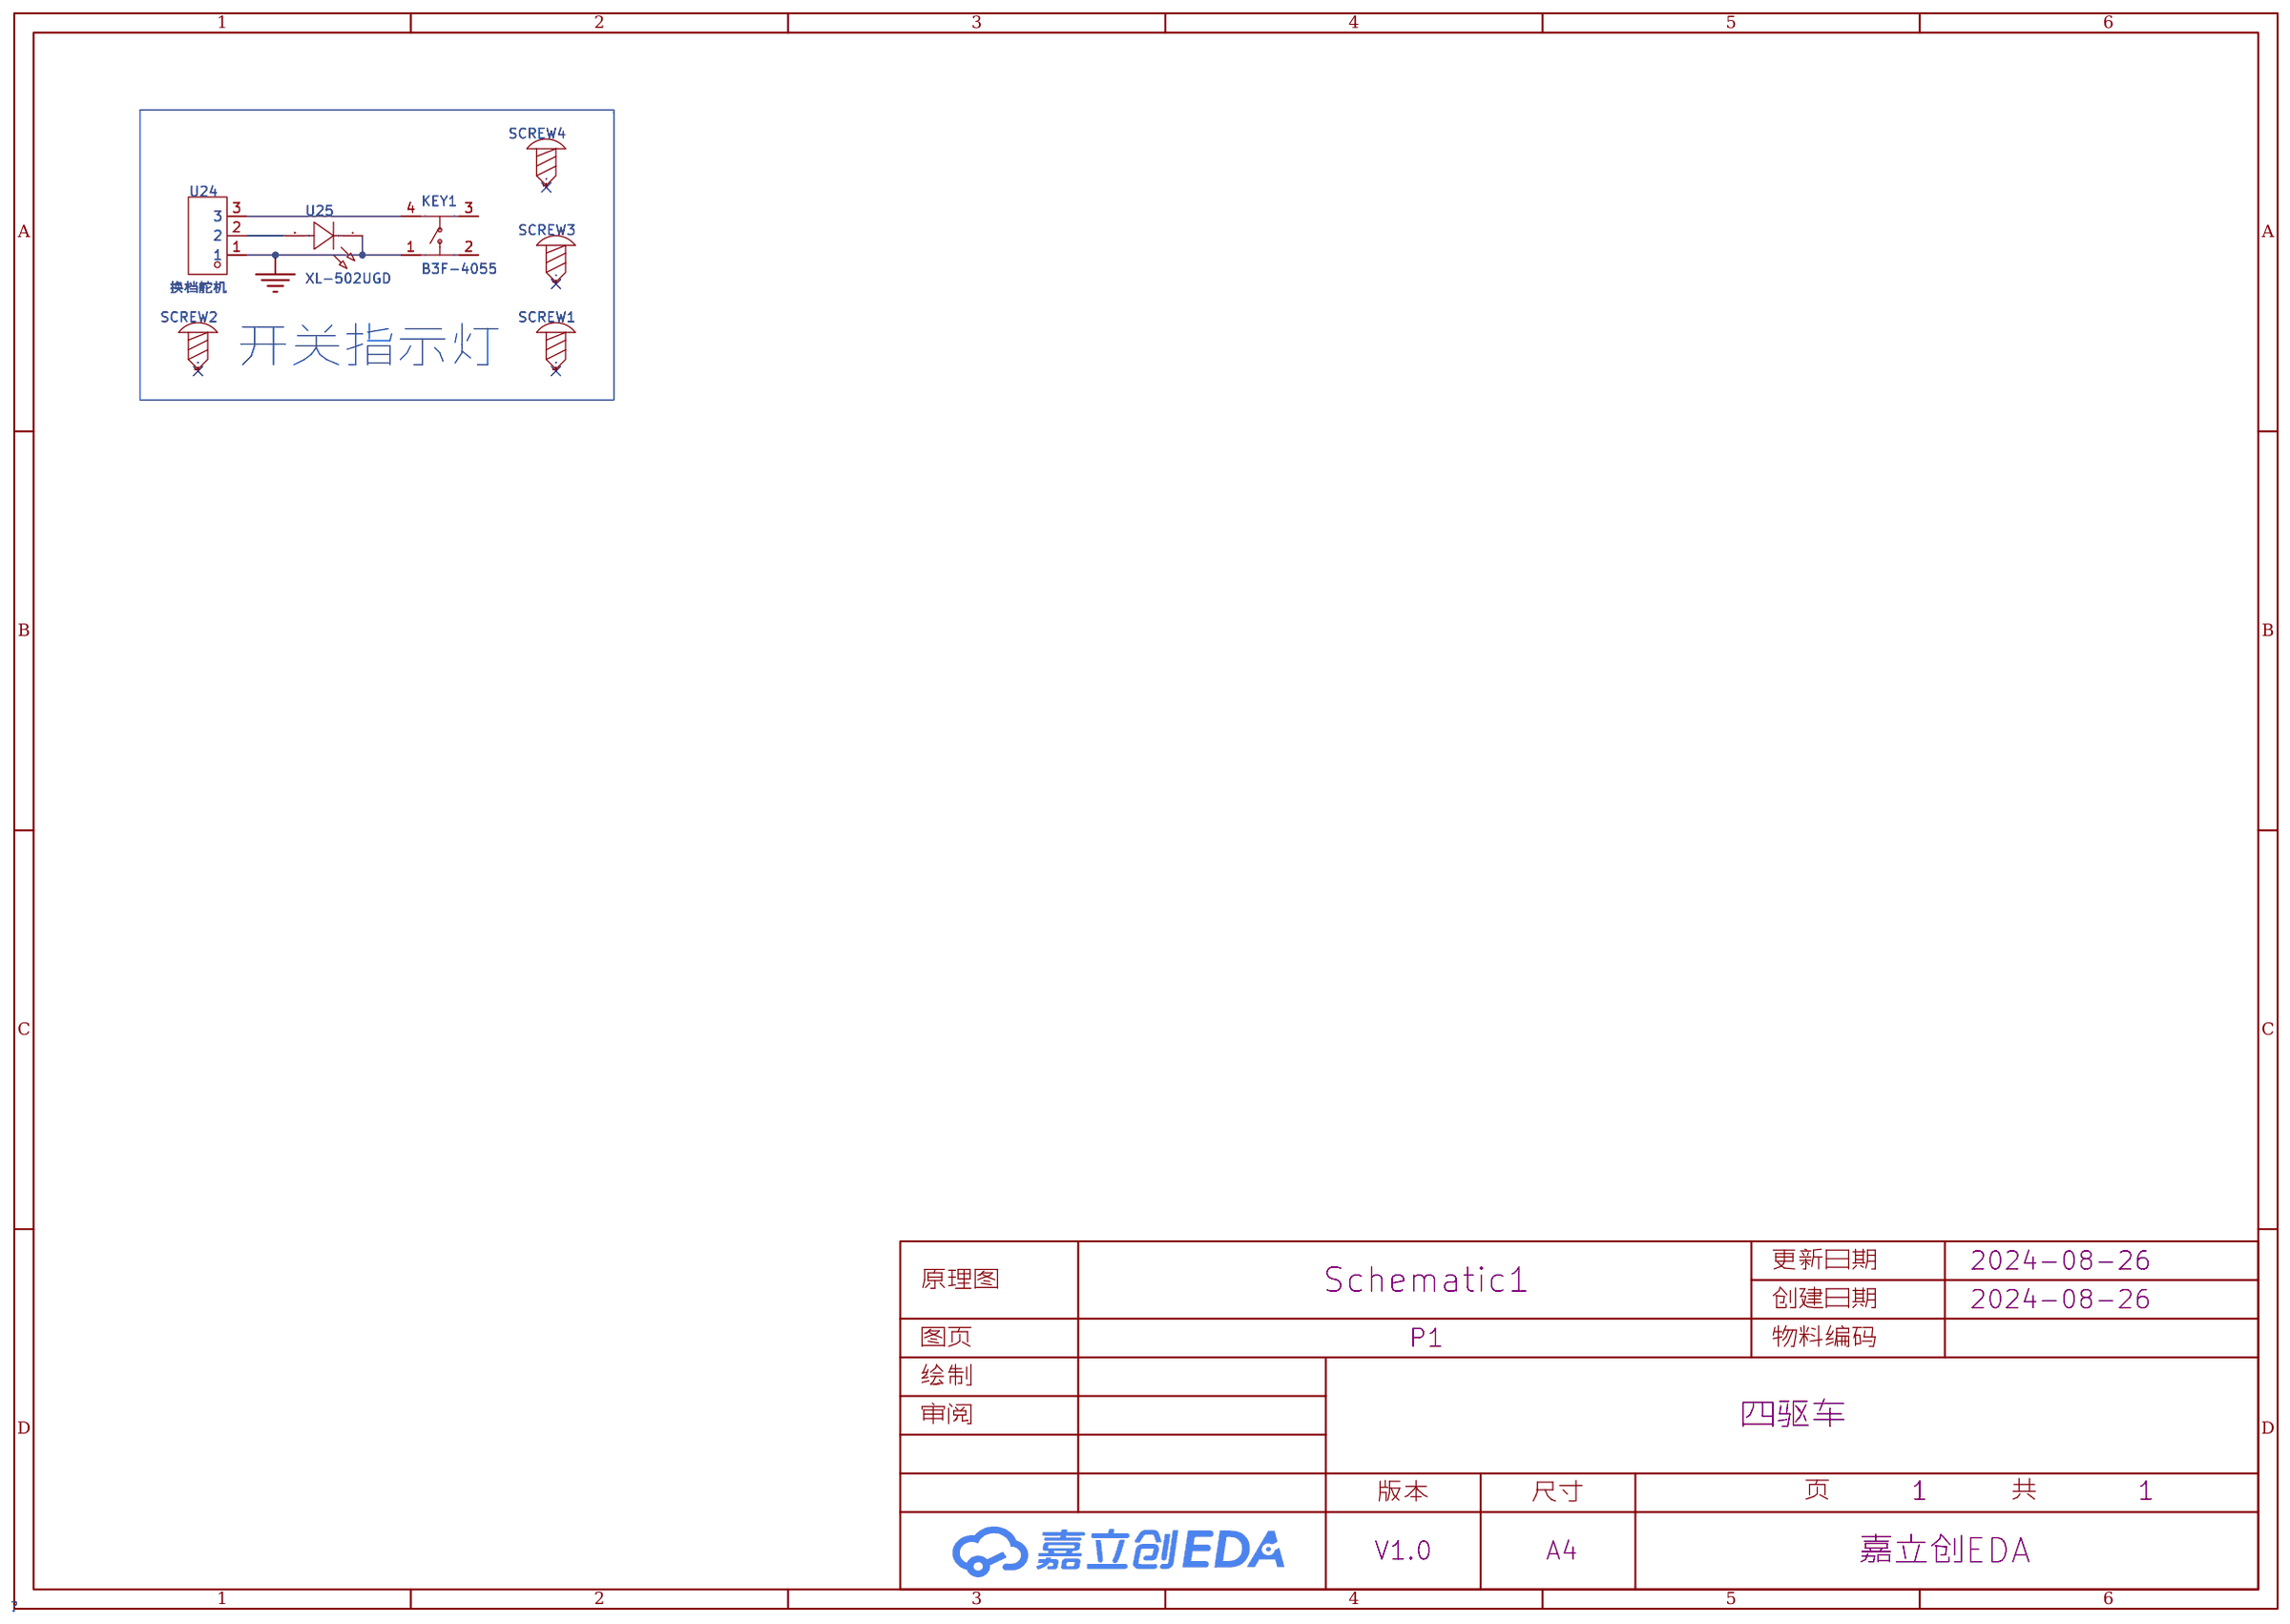
[diagram p2: schematic sheet]

## Parts
KEY1  B3F-4055  [KEY-TH_4P-L12.0-W12.0-P5.00-LS13.4-EH]
SCREW1  -  [M2螺丝]
SCREW2  -  [M2螺丝]
SCREW3  -  [M2螺丝]
SCREW4  -  [M2螺丝]
U24  换档舵机  [CONN-TH_3P-P2.54_2501S-3P]
U25  XL-502UGD  [LED-TH_BD5.9-P2.54-RD_GREEN]

## Library data of the parts
KEY1 = B3F-4055_C84931: 电路结构:单刀单掷;按钮形状:矩形按钮;安装方式:直插;开关长度:12mm;开关宽度:12mm;开关高度:7.3mm;触点电流:50mA;额定电压(DC):24V;带灯:-;机械寿命:-;; LCSC Part Name: 12*12*7.3mm 直插 轻触开关; Supplier Part: C84931; Manufacturer: OMRON(欧姆龙); Supplier Footprint: 插件; JLCPCB Part Class: 扩展库; Datasheet: https://atta.szlcsc.com/upload/public/pdf/source/20170810/C93157_1502335414592880008.pdf; Supplier: LCSC; Circuit: 单刀单掷; Actuator Style: 矩形按钮; Mounting Style: 直插; Switch Length: 12mm; Switch Width: 12mm; Switch Height: 7.3mm; Contact Current: 50mA; Voltage Rating (DC): 24V
SCREW1-SCREW4 = M2螺丝: Supplier Footprint: 插件
U24 = ZX-XH2.54-3PZZ: 插针结构:1x3P;间距:2.54mm;安装方式:直插;参考系列:XH;总PIN数:3P;排数:1;每排PIN数:3;行距:-;额定电流:3A;触头材质:黄铜;触头镀层:锡;工作温度范围:-25℃~+85℃;; Supplier Part: C7429633; Manufacturer: Megastar(兆星); Supplier Footprint: 插件,P=2.54mm; JLCPCB Part Class: 扩展库; Datasheet: https://atta.szlcsc.com/upload/public/pdf/source/20230619/AE17037A2CFDBE8D9CBA775D61AD0A84.pdf; Supplier: LCSC; Pins Structure: 1x3P; Pitch: 2.54mm; Mounting Style: 直插; Reference Series: XH; Number of Pins: 3P; Number of Rows: 1; Number of PINs Per Row: 3; Current Rating (Max): 3A; Contact Material: 黄铜; Contact Plating: 锡; Operating Temperature Range: -25℃~+85℃
U25 = XL-502UGD: 灯头类型:5mm圆形灯头;发光颜色:翠绿色;功率:80mW;正向电流:30mA;主波长:515nm~520nm;透镜颜色:绿色透镜;色温:-;发光角度:50°;载带方式:-;工作温度:-25℃~+85℃;; Supplier Part: C2895548; Manufacturer: XINGLIGHT(成兴光); Supplier Footprint: 插件,D=5mm; JLCPCB Part Class: 扩展库; Datasheet: https://atta.szlcsc.com/upload/public/pdf/source/20240112/069024ED60A10A0E09F0F24A9490946D.pdf; Supplier: LCSC; Lamp Holder Type: 5mm圆形灯头; Emitted Color: 翠绿色; Power Dissipation: 80mW; Forward Current: 30mA; Dominant Wavelength: 515nm~520nm; Peak Wavelength: 525nm; Lens Color: 绿色透镜; Viewing Angle: 50°; Operating Temperature: -25℃~+85℃

## Nets
GND: KEY1.1 U24.1 U25.1(K)
$1N199: U24.2 U25.2(A)
$1N370: KEY1.4 U24.3

Not connected (* = marked no-connect by the designer): KEY1 2 3; SCREW1 1*; SCREW2 1*; SCREW3 1*; SCREW4 1*

## Notes on the sheet
- 开关指示灯

# Board PCB1
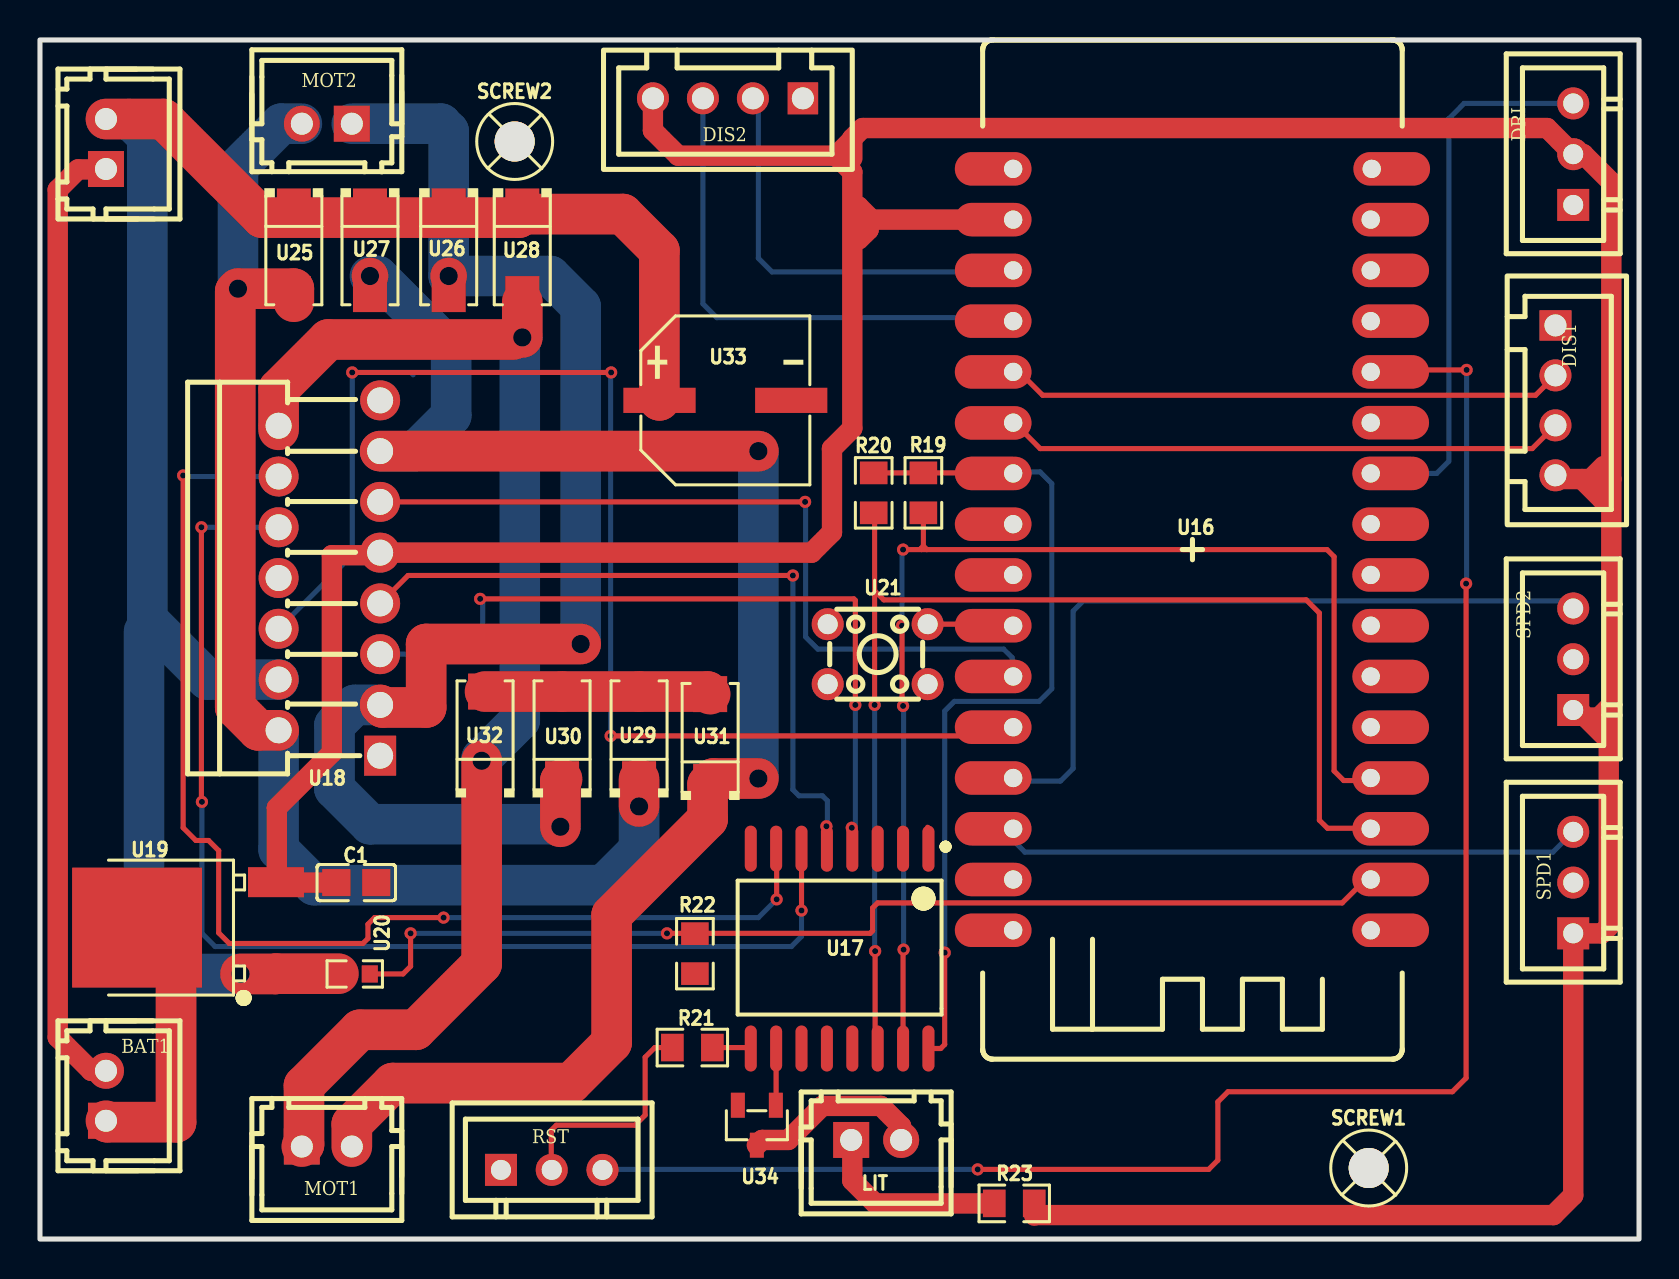
[diagram p3: board, top side]
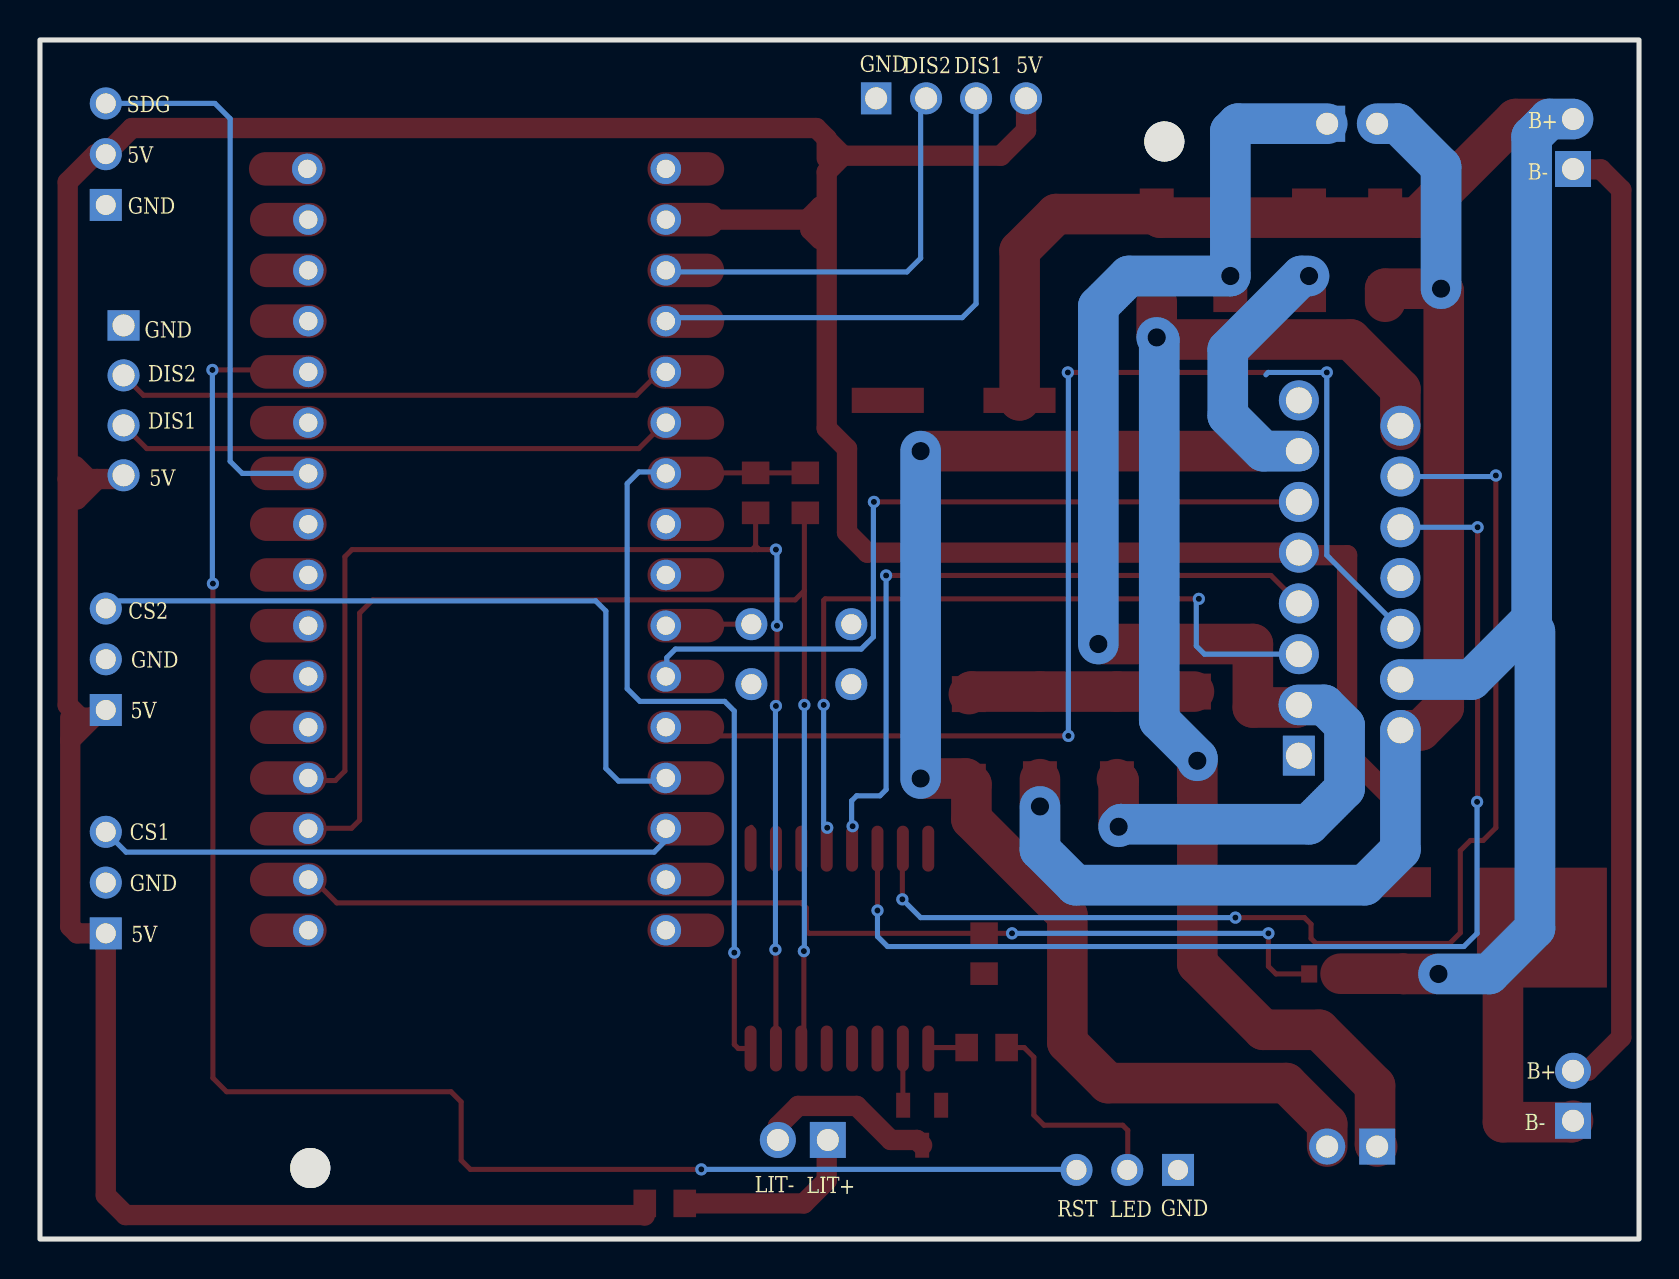
[diagram p4: board, bottom side, seen from below]

Outline 80 x 60 mm; copper layers: Top Layer, Bottom Layer. Coordinates in mm from the lower left corner of the outline.
Outline path: rectangle 0,60 80,0
Stack: Top Layer 0.035mm / Dielectric1 1.51mm FR4 er 4.5 / Bottom Layer 0.035mm

## Design rules (mm)
template: JLCPCB Capability(Two Layers Board)
spacing copperThickness1oz (default): track to track 0.102, other pairs 0.152 to 0.3
spacing copperThickness2oz: track to track 0.203, other pairs 0.152 to 0.3
track width copperThickness1oz (default): min 0.127, default 0.254, max 2.54
track width copperThickness2oz: min 0.203, default 0.254, max 2.54
differential pair differentialPair (default): width min 0.127, default 0.254, max 2.54; gap min 0.152, default 0.152
via viaSize (default): diameter min 0.5, default 0.61, max 10; hole min 0.3, default 0.305, max 6.3

## Placement (name value [footprint] x y rotation side)
BAT1  电池接口1  [CONN-TH_2P-P2.50_HX25003-2A]  3.3 7.17 90 top
BAT2  电池接口2  [CONN-TH_2P-P2.50_HX25003-2A]  3.3 54.79 90 top
C1  100nF  [C0805]  15.82 17.84 0 top
DIS1  超声波1  [CONN-TH_4P-P2.50_4PIN]  75.82 41.97 270 top
DIS2  超声波2  [CONN-TH_4P-P2.50_4PIN]  34.42 57.08 180 top
DRI  换档舵机  [CONN-TH_3P-P2.54_2501S-3P]  76.71 54.28 90 top
LIT  灯光  [CONN-TH_2P-P2.50_HX25003-2A]  41.83 4.96 0 top
MOT1  输出电机接口1  [CONN-TH_2P-P2.50_HX25003-2A]  14.35 4.63 0 top
MOT2  输出电机接口2  [CONN-TH_2P-P2.50_HX25003-2A]  14.35 55.81 180 top
R19  4.7kΩ  [R0805]  44.2 37.34 90 top
R20  4.7kΩ  [R0805]  41.71 37.34 90 top
R21  1kΩ  [R0805]  32.64 9.58 0 top
R22  1kΩ  [R0805]  32.77 14.28 270 top
R23  1kΩ  [R0805]  48.74 1.78 0 top
RST  开关重置  [CONN-TH_3P-P2.54_2501S-3P]  25.6 3.46 0 top
SCREW1  -  [M2螺丝]  66.48 3.55 0 top
SCREW2  -  [M2螺丝]  23.75 54.92 0 top
SPD1  测速度左  [CONN-TH_3P-P2.54_2501S-3P]  76.71 17.84 90 top
SPD2  测速度右  [CONN-TH_3P-P2.54_2501S-3P]  76.71 29.01 90 top
U16  ESP32C3-合宙  [esp32c3-合宙]  57.66 34.49 180 top
U17  PCF8574T  [SOP-16_L10.3-W7.5-P1.27-LS10.4-BL]  40 14.53 180 top
U18  L298N  [MULTIWATT-15_L19.6-W5.0-P1.27-L]  14.48 33.08 90 top
U19  L78M05ABDT-TR  [TO-252-2_L6.5-W6.1-P4.58-LS10.0-TL]  8.33 15.57 180 top
U20  2kΩ  [R0603]  15.75 13.26 0 top
U21  TS4543CJ 250gf 009  [SW-TH_4P-L4.5-W4.5-P3.00-LS5.0]  41.91 29.27 180 top
U25  M7  [SMA_L4.5-W2.7-LS5.1-RD]  12.7 49.48 270 top
U26  M7  [SMA_L4.5-W2.7-LS5.1-RD]  20.45 49.48 270 top
U27  M7  [SMA_L4.5-W2.7-LS5.1-RD]  16.51 49.48 270 top
U28  M7  [SMA_L4.5-W2.7-LS5.1-RD]  24.13 49.48 270 top
U29  M7  [SMA_L4.5-W2.7-LS5.1-RD]  29.97 25.2 90 top
U30  M7  [SMA_L4.5-W2.7-LS5.1-RD]  26.12 25.2 90 top
U31  M7  [SMA_L4.5-W2.7-LS5.1-RD]  33.53 25.07 90 top
U32  M7  [SMA_L4.5-W2.7-LS5.1-RD]  22.27 25.2 90 top
U33  220uF  [CAP-SMD_BD8.0-L8.3-W8.3-LS9.1-FD]  34.29 41.97 0 top
U34  BSS123  [SOT-23-3_L2.9-W1.3-P1.90-LS2.4-BR]  35.86 5.69 90 top

## Footprints (pads in the part's own frame, mm; a bottom-side part is the same pattern mirrored in y, then rotated)
C0805
  rect 1.41x1.35 smd: 1(-1,0) 2(1,0)
CAP-SMD_BD8.0-L8.3-W8.3-LS9.1-FD
  rect 3.61x1.26 smd: 1(-3.295,0) 2(3.295,0)
CONN-TH_2P-P2.50_HX25003-2A
  rect 1.8x1.8 hole 1.1: 1(-1.25,0)
  round 1.8 hole 1.1: 2(1.25,0)
CONN-TH_3P-P2.54_2501S-3P
  rect 1.6x1.6 hole 1: 1(-2.54,0)
  round 1.6 hole 1: 2(0,0) 3(2.54,0)
CONN-TH_4P-P2.50_4PIN
  rect 1.524x1.6 hole 1.1: 1(-3.75,0)
  round 1.6 hole 1.1: 2(-1.25,0) 3(1.25,0) 4(3.75,0)
esp32c3-合宙
  oval 3.836x1.677 smd: 1(-9.918,19.038) 2(-9.918,16.498) 3(-9.918,13.958) 4(-9.918,11.418) 5(-9.918,8.878) 6(-9.918,6.338) 7(-9.918,3.798) 8(-9.918,1.258) 9(-9.918,-1.282) 10(-9.918,-3.822) 11(-9.918,-6.362) 12(-9.918,-8.902) 13(-9.918,-11.442) 14(-9.918,-13.982) 15(-9.918,-16.522) 16(-9.97,-19.062) 17(9.97,19.038) 18(9.97,16.498) 19(9.97,13.958) 20(9.97,11.418) 21(9.97,8.878) 22(9.97,6.338) 23(9.97,3.798) 24(9.97,1.258) 25(9.97,-1.282) 26(9.97,-3.822) 27(9.97,-6.35) 28(9.97,-8.902) 29(9.97,-11.442) 30(9.97,-13.982) 31(9.97,-16.522) 32(9.97,-19.062)
  round 1.524 hole 0.914: 1(-8.918,19.038) 2(-8.918,16.498) 3(-8.918,13.958) 4(-8.918,11.418) 5(-8.918,8.878) 6(-8.918,6.338) 7(-8.918,3.798) 8(-8.918,1.258) 9(-8.918,-1.282) 10(-8.918,-3.822) 11(-8.918,-6.362) 12(-8.918,-8.902) 13(-8.918,-11.442) 14(-8.918,-13.982) 15(-8.918,-16.522) 16(-8.97,-19.062) 17(8.97,19.038) 18(8.97,16.498) 19(8.97,13.958) 20(8.97,11.418) 21(8.97,8.878) 22(8.97,6.338) 23(8.97,3.798) 24(8.97,1.258) 25(8.97,-1.282) 26(8.97,-3.822) 27(8.97,-6.362) 28(8.97,-8.902) 29(8.97,-11.442) 30(8.97,-13.982) 31(8.97,-16.522) 32(8.97,-19.062)
M2螺丝
  round 2 hole 2: 1(0,0)
MULTIWATT-15_L19.6-W5.0-P1.27-L
  rect 2x1.6 hole 1.3: 1(-8.89,-2.54)
  round 2 hole 1.3: 2(-7.62,2.54) 3(-6.35,-2.54) 4(-5.08,2.54) 5(-3.81,-2.54) 6(-2.54,2.54) 7(-1.27,-2.54) 8(0,2.54) 9(1.27,-2.54) 10(2.54,2.54) 11(3.81,-2.54) 12(5.08,2.54) 13(6.35,-2.54) 14(7.62,2.54) 15(8.89,-2.54)
R0603
  rect 0.806x0.864 smd: 1(-0.753,0) 2(0.753,0)
R0805
  rect 1.133x1.377 smd: 1(-1,0) 2(1,0)
SMA_L4.5-W2.7-LS5.1-RD
  rect 1.8x1.7 smd: 1(-2.192,0) 2(2.192,0)
SOP-16_L10.3-W7.5-P1.27-LS10.4-BL
  oval 0.6x2.3 smd: 1(-4.445,-5) 2(-3.175,-5) 3(-1.905,-5) 4(-0.635,-5) 5(0.635,-5) 6(1.905,-5) 7(3.175,-5) 8(4.445,-5) 9(4.445,5) 10(3.175,5) 11(1.905,5) 12(0.635,5) 13(-0.635,5) 14(-1.905,5) 15(-3.175,5) 16(-4.445,5)
SOT-23-3_L2.9-W1.3-P1.90-LS2.4-BR
  rect 1.25x0.7 smd: 1(1,-0.95) 2(1,0.95) 3(-1,0)
SW-TH_4P-L4.5-W4.5-P3.00-LS5.0
  round 1.6 hole 1: 1(-2.5,1.5) 2(2.5,1.5) 3(-2.5,-1.5) 4(2.5,-1.5)
TO-252-2_L6.5-W6.1-P4.58-LS10.0-TL
  rect 2.8x1.35 smd: 1(-3.475,2.29)
  rect 2.8x1.5 smd: 3(-3.475,-2.29)
  rect 6.5x6 smd: 4(3.475,-0.017)

## Nets
As in the schematic.

Pads without a net: SCREW1 1; SCREW2 1; U16 1 5 6 7 8 9 11 13 14 15 16 17 18 24 25; U17 11 12 13; U21 2 4

## Via types
v1: diameter 1.829, hole 0.914, Top Layer to Bottom Layer, 11 vias
v2: diameter 0.61, hole 0.305, Top Layer to Bottom Layer, 27 vias

## Routing (per net, layer and track width the routed paths; a pad name or vN(x,y) marks a point on that pad's centre or on a via; arc(x,y) is an arc through that point)
+3.3V: length 42.9
  Top Layer w0.254: U17.16 45.06,9.53 45.26,9.73 v2(45.26,14.33) ; R20.2 R19.2 47.66,38.34 U16.26 U16.26
  Bottom Layer w0.254: U16.26 48.76,38.38 50.04,38.38 50.62,37.8 50.62,27.54 49.99,26.9 45.75,26.9 45.26,26.42 v2(45.26,14.33)
+5V: length 215.5
  Top Layer w1.016: 12.14,17.91 12.22,17.84 C1.1 ; 77.35,26.09 76.97,26.47 SPD2.1 ; 77.35,26.09 77.99,26.09 78.61,26.71 78.61,38.03 ; 77.35,26.09 78.49,24.96 ; 41.45,50.78 41.45,50.5 40.97,50.02 ; 78.61,38.03 78.61,52.89 77.22,54.28 DRI.2 75.4,55.59 41.16,55.59 40.64,55.07 40.64,55.03 ; 78.61,38.03 77.58,38.03 ; 78.49,26.09 78.49,24.96 ; 78.49,24.96 78.49,15.64 78.14,15.3 SPD1.1 76.71,2.19 75.72,1.2 49.77,1.2 49.74,1.17 ; 78.36,37.01 78.15,37.01 77.13,38.03 ; 40.64,55.03 40.64,54.08 ; 40.64,55.03 39.82,54.21 ; 39.82,54.21 40.64,53.39 40.64,40.57 39.62,39.55 39.62,35.36 38.61,34.35 17.02,34.35 16.89,34.22 14.6,34.22 14.6,24.33 11.85,21.58 11.85,17.9 U19.3 ; 39.82,54.21 31.93,54.21 30.67,55.47 DIS2.4 ; DIS1.4 76.01,38.03 77.13,38.03 ; 77.13,38.03 77.58,38.03 ; 77.58,38.03 78.23,38.68 ; 40.92,51.67 40.95,51.67 41.58,51.04 41.58,51.01 U16.31
+7.4V: length 98
  Top Layer w2.032: v1(10.03,13.26) 11.79,13.26 U19.1 14.93,13.28 ; U33.1 30.99,41.97 30.99,49.46 29.16,51.29 24.13,51.29 23.95,51.11 11.11,51.11 6.18,56.04 BAT2.2
  Bottom Layer w2.032: 5.21,30.41 5.21,15.55 7.49,13.26 v1(10.03,13.26) ; BAT2.2 4.49,56.04 5.37,55.16 5.37,31.01 8.38,28 U18.4
GND: length 26.5
  Top Layer w0.254: 44.41,20.6 44.41,19.57 U17.1
  Top Layer w2.032: U19.4 6.81,13.63 6.81,5.85 3.37,5.85 BAT1.1 ; U31.2 33.4,27.39 U29.2 U30.2 U32.2
IO_CS1: length 29.3
  Bottom Layer w0.254: U16.19 48.69,19.95 49.28,19.36 75.69,19.36 SPD1.3
IO_CS2: length 36.6
  Bottom Layer w0.254: SPD2.3 76.33,31.93 52.2,31.93 51.69,31.42 51.69,23.55 51.05,22.92 48.84,22.92 U16.20
IO_DRIVER11: length 39
  Top Layer w0.254: v2(22.02,32.03) 40.72,32.03 40.79,31.96 v2(40.79,26.73) ; v2(40.61,20.58) 40.61,19.56 40.64,19.53
  Bottom Layer w0.254: v2(22.02,32.03) 22.15,31.91 22.15,29.67 21.74,29.27 17.02,29.27 ; v2(40.61,20.58) 40.79,20.76 v2(40.79,26.73)
IO_DRIVER12: length 36.3
  Top Layer w0.254: v2(37.67,33.2) 18.41,33.2 17.02,31.81 ; v2(39.34,20.66) 39.34,19.56 U17.5
  Bottom Layer w0.254: v2(37.67,33.2) 37.67,22.48 37.97,22.18 39.14,22.18 39.4,21.93 39.4,20.71 v2(39.34,20.66)
IO_DRIVER21: length 59.1
  Top Layer w0.254: v2(38.1,16.44) U17.6 ; v2(8.08,35.62) 8.08,21.9 v2(8.1,21.87)
  Bottom Layer w0.254: v2(8.08,35.62) U18.10 ; v2(8.1,21.87) 8.1,15.3 8.76,14.64 37.59,14.64 38.1,15.14 v2(38.1,16.44)
IO_DRIVER22: length 60.8
  Top Layer w0.254: v2(20.19,16.08) 16.74,16.08 16.41,15.75 16.41,15.04 16.15,14.79 9.47,14.79 8.94,15.32 8.94,19.44 8.43,19.94 7.8,19.94 7.16,20.58 v2(7.16,38.21) ; U17.7 36.86,19.51 v2(36.86,17)
  Bottom Layer w0.254: v2(36.86,17) 35.94,16.08 v2(20.19,16.08) ; v2(7.16,38.21) 7.21,38.16 U18.12
IO_LED: length 11.2
  Top Layer w0.254: 31.67,9.58 30.76,9.58 30.28,9.1 30.28,6.2 29.77,5.69 25.83,5.69 25.58,5.44 25.58,3.71
IO_PWM1: length 68.9
  Top Layer w0.254: v2(28.58,43.36) v2(15.62,43.36) ; v2(28.55,25.18) 48.25,25.18 U16.21
  Bottom Layer w0.254: U18.6 15.62,34.22 v2(15.62,43.36) 18.55,43.36 18.67,43.25 ; v2(28.58,43.36) 28.55,43.34 v2(28.55,25.18)
IO_PWM2: length 39.8
  Top Layer w0.254: v2(38.28,36.89) 17.02,36.89
  Bottom Layer w0.254: v2(38.28,36.89) 38.3,36.86 38.3,30.13 38.91,29.52 48.21,29.52 48.64,29.09 48.64,28.2 U16.22
IO_RADAR11: length 29.1
  Top Layer w0.254: DIS1.3 74.66,39.55 50.04,39.55 48.75,40.84 U16.27
IO_RADAR12: length 28
  Top Layer w0.254: DIS1.2 74.82,42.22 50.17,42.22 48.99,43.39 U16.28
IO_RADAR21: length 26.2
  Bottom Layer w0.254: DIS2.3 33.17,46.8 33.86,46.11 48.51,46.11 U16.29
IO_RADAR22: length 21.2
  Bottom Layer w0.254: U16.30 48.61,48.39 36.63,48.39 35.94,49.08 35.94,56.8 DIS2.2
IO_REST: length 86.1
  Top Layer w0.254: v2(71.37,43.49) 67.68,43.49 U16.12 ; v2(71.35,32.8) 71.35,8.06 70.66,7.37 59.44,7.37 58.93,6.86 58.93,3.94 58.47,3.48 v2(46.91,3.48)
  Bottom Layer w0.254: v2(71.35,32.8) 71.37,32.82 v2(71.37,43.49) ; RST.3 28.17,3.48 v2(46.91,3.48)
IO_SGD: length 27.8
  Bottom Layer w0.254: U16.10 69.88,38.31 70.48,38.92 70.48,56.06 71.25,56.82 76.71,56.82
SCL_IOE: length 62.7
  Top Layer w0.254: v2(41.78,14.41) 41.78,9.66 U17.14 ; 41.76,32.44 41.76,36.29 R20.1 ; 41.76,32.44 v2(41.76,26.73) ; 41.76,32.44 42.21,31.98 63.35,31.98 64.01,31.32 64.01,20.96 64.41,20.55 66.55,20.55 U16.3
  Bottom Layer w0.254: v2(41.78,14.41) 41.76,14.43 v2(41.76,26.73)
SDA_IOE: length 61.7
  Top Layer w0.254: 44.11,34.5 44.06,34.54 44.2,34.68 ; 44.11,34.5 44.37,34.5 ; 44.11,34.5 v2(43.18,34.5) ; U16.4 66.45,22.94 65.23,22.94 64.74,23.42 64.74,34.14 64.39,34.5 44.37,34.5 ; 44.2,34.68 R19.1 ; 44.2,34.68 44.37,34.5 ; v2(43.13,30.69) 43.13,26.73 v2(43.18,26.67) ; U17.15 43.18,14.46 v2(43.21,14.48)
  Bottom Layer w0.254: v2(43.18,34.5) 43.13,34.45 v2(43.13,30.69) ; v2(43.18,26.67) 43.21,26.65 v2(43.21,14.48)
$1N15876: length 48.4
  Top Layer w1.016: BAT2.1 3.28,53.52 1.9,53.52 0.89,52.51 0.89,10.09 2.56,8.42 BAT1.2
$1N17735: length 54.7
  Top Layer w0.254: U16.2 66.32,17.99 65.15,16.82 41.91,16.82 41.66,16.57 41.66,15.42 41.53,15.3 32.75,15.3 ; v2(18.54,15.3) 18.54,13.64 18.16,13.26 U20.2 ; 32.75,15.3 v2(31.37,15.3) ; 32.75,15.3 R22.1
  Bottom Layer w0.254: v2(18.54,15.3) v2(31.37,15.3)
$1N18534: length 4.3
  Top Layer w0.254: U16.23 48.61,30.77 U21.3
$1N19447: length 70
  Top Layer w2.032: v1(26.03,20.63) 26.03,22.92 U30.1 ; 17.02,26.73 17.14,26.6 19.32,26.6 19.32,29.77 v1(27.05,29.77)
  Bottom Layer w2.032: 17.02,26.73 15.75,26.73 14.73,25.71 14.73,22.53 16.51,20.76 25.91,20.76 v1(26.03,20.63) ; MOT2.1 20.07,55.81 20.45,55.43 v1(20.45,48.19) 25.53,48.19 27.05,46.66 v1(27.05,29.77)
$1N19452: length 66.3
  Top Layer w2.032: v1(29.97,21.65) U29.1 ; U18.2 10.92,25.46 9.77,26.61 9.77,47.42 v1(9.91,47.55) 12.7,47.55 12.7,46.9
  Bottom Layer w2.032: v1(29.97,21.65) 29.97,19.49 28.19,17.71 13.72,17.71 11.94,19.49 U18.2 ; v1(9.91,47.55) 9.91,53.65 12.06,55.81 MOT2.2
$1N19565: length 63.3
  Top Layer w2.032: v1(22.1,23.93) 22.1,13.77 18.8,10.47 16,10.47 13.21,7.68 13.21,4.73 MOT1.1 ; 23.67,45.01 14.43,45.01 11.94,42.52 11.94,40.49 ; v1(24.13,45.12) 24.13,46.9
  Bottom Layer w2.032: v1(24.13,45.12) 24,44.99 24,25.96 22.1,24.06 v1(22.1,23.93)
$1N19566: length 81.9
  Top Layer w2.032: v1(35.94,23.04) 33.69,23.04 U31.1 33.4,22.76 33.4,21.01 28.6,16.21 28.6,9.83 26.57,7.8 17.65,7.8 15.6,5.75 MOT1.2 ; 17.02,39.43 v1(35.94,39.43)
  Bottom Layer w2.032: v1(35.94,39.43) v1(35.94,23.04) ; 17.02,39.43 18.8,39.43 20.57,41.2 20.57,44.51 16.89,48.19 v1(16.51,48.19)
$1N24130: length 1.9
  Top Layer w0.254: R21.2 35.51,9.58 U17.9
$1N26486: length 2.8
  Top Layer w0.254: U17.10 36.83,6.71 U34.1
$1N26625: length 9.1
  Top Layer w1.016: U34.3 36.13,4.96 37.44,4.96 39.14,6.66 42.07,6.66 43.08,5.64 43.08,4.96
$1N26643: length 9.6
  Top Layer w1.016: R23.1 41.78,1.78 40.64,2.93 40.64,4.9 LIT.1

## Copper pours and planes (outline as drawn; the poured copper is in the pictures)
GND on Top Layer: -3.86,62.92 84.12,62.92 84.12,-3.22 -3.86,-3.22
GND on Bottom Layer: -2.08,61.47 82.32,61.47 82.32,-1.62 -2.08,-1.62

## Text on the board
Bottom Silkscreen Layer: B+ | B- | GND | LED | RST | 5V | DIS1 | DIS2 | LIT+ | LIT- | CS1 | CS2 | SDG

# Board PCB4
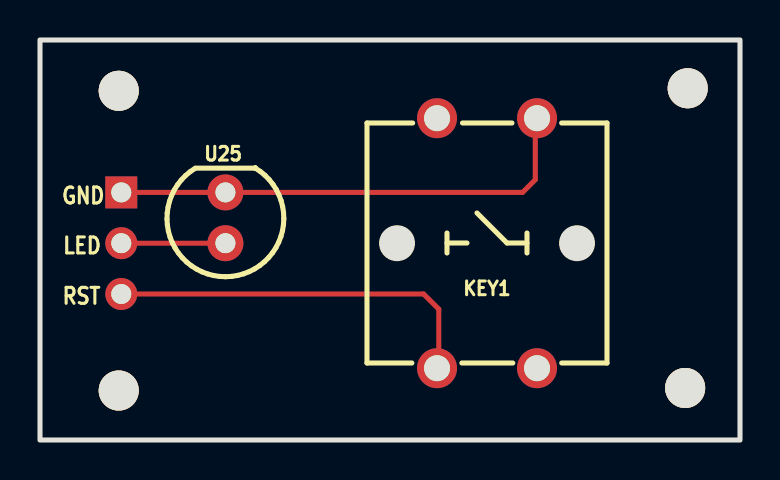
[diagram p5: board, top side]
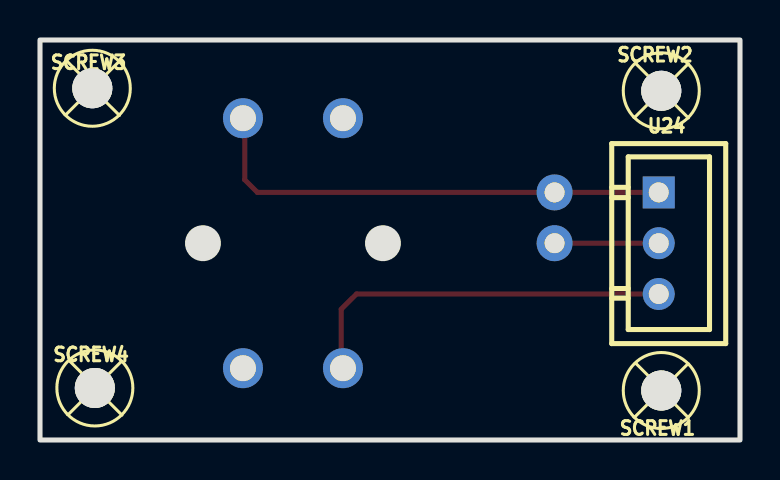
[diagram p6: board, bottom side, seen from below]

Outline 35 x 20 mm; copper layers: Top Layer, Bottom Layer. Coordinates in mm from the lower left corner of the outline.
Outline path: rectangle 0,20 35,0
Stack: Top Layer 0.035mm / Dielectric1 1.51mm FR4 er 4.5 / Bottom Layer 0.035mm

## Design rules (mm)
template: JLCPCB Capability(Two Layers Board)
spacing copperThickness1oz (default): track to track 0.102, other pairs 0.152 to 0.3
spacing copperThickness2oz: track to track 0.203, other pairs 0.152 to 0.3
track width copperThickness1oz (default): min 0.127, default 0.254, max 2.54
track width copperThickness2oz: min 0.203, default 0.254, max 2.54
differential pair differentialPair (default): width min 0.127, default 0.254, max 2.54; gap min 0.152, default 0.152
via viaSize (default): diameter min 0.5, default 0.61, max 10; hole min 0.3, default 0.305, max 6.3

## Placement (name value [footprint] x y rotation side)
KEY1  B3F-4055  [KEY-TH_4P-L12.0-W12.0-P5.00-LS13.4-EH]  22.35 9.84 90 top
SCREW1  -  [M2螺丝]  3.94 2.47 180 bottom
SCREW2  -  [M2螺丝]  3.94 17.46 180 bottom
SCREW3  -  [M2螺丝]  32.38 17.59 180 bottom
SCREW4  -  [M2螺丝]  32.26 2.6 180 bottom
U24  换档舵机  [CONN-TH_3P-P2.54_2501S-3P]  4.06 9.84 270 bottom
U25  XL-502UGD  [LED-TH_BD5.9-P2.54-RD_GREEN]  9.27 11.11 270 top

## Footprints (pads in the part's own frame, mm; a bottom-side part is the same pattern mirrored in y, then rotated)
CONN-TH_3P-P2.54_2501S-3P
  rect 1.6x1.6 hole 1: 1(-2.54,0)
  round 1.6 hole 1: 2(0,0) 3(2.54,0)
KEY-TH_4P-L12.0-W12.0-P5.00-LS13.4-EH
  round 2 hole 1.3: 1(6.25,-2.5) 2(-6.25,-2.5) 3(6.25,2.5) 4(-6.25,2.5)
LED-TH_BD5.9-P2.54-RD_GREEN
  round 1.8 hole 1: 1(-1.27,0) 2(1.27,0)
M2螺丝
  round 2 hole 2: 1(0,0)

## Nets
As in the schematic.

Pads without a net: KEY1 2 3; SCREW1 1; SCREW2 1; SCREW3 1; SCREW4 1

## Routing (per net, layer and track width the routed paths; a pad name or vN(x,y) marks a point on that pad's centre or on a via; arc(x,y) is an arc through that point)
GND: length 24.7
  Top Layer w0.254: U24.1 24.13,12.38 24.76,13.02 24.76,15.84 24.13,16.47
$1N199: length 5.2
  Top Layer w0.254: U25.2 U24.2
$1N370: length 19.5
  Top Layer w0.254: U24.3 19.18,7.3 19.94,6.54 19.94,4.44 19.09,3.59

## Text on the board
Top Silkscreen Layer: GND | RST | LED
